# Altium project AlanPC.PrjPcb
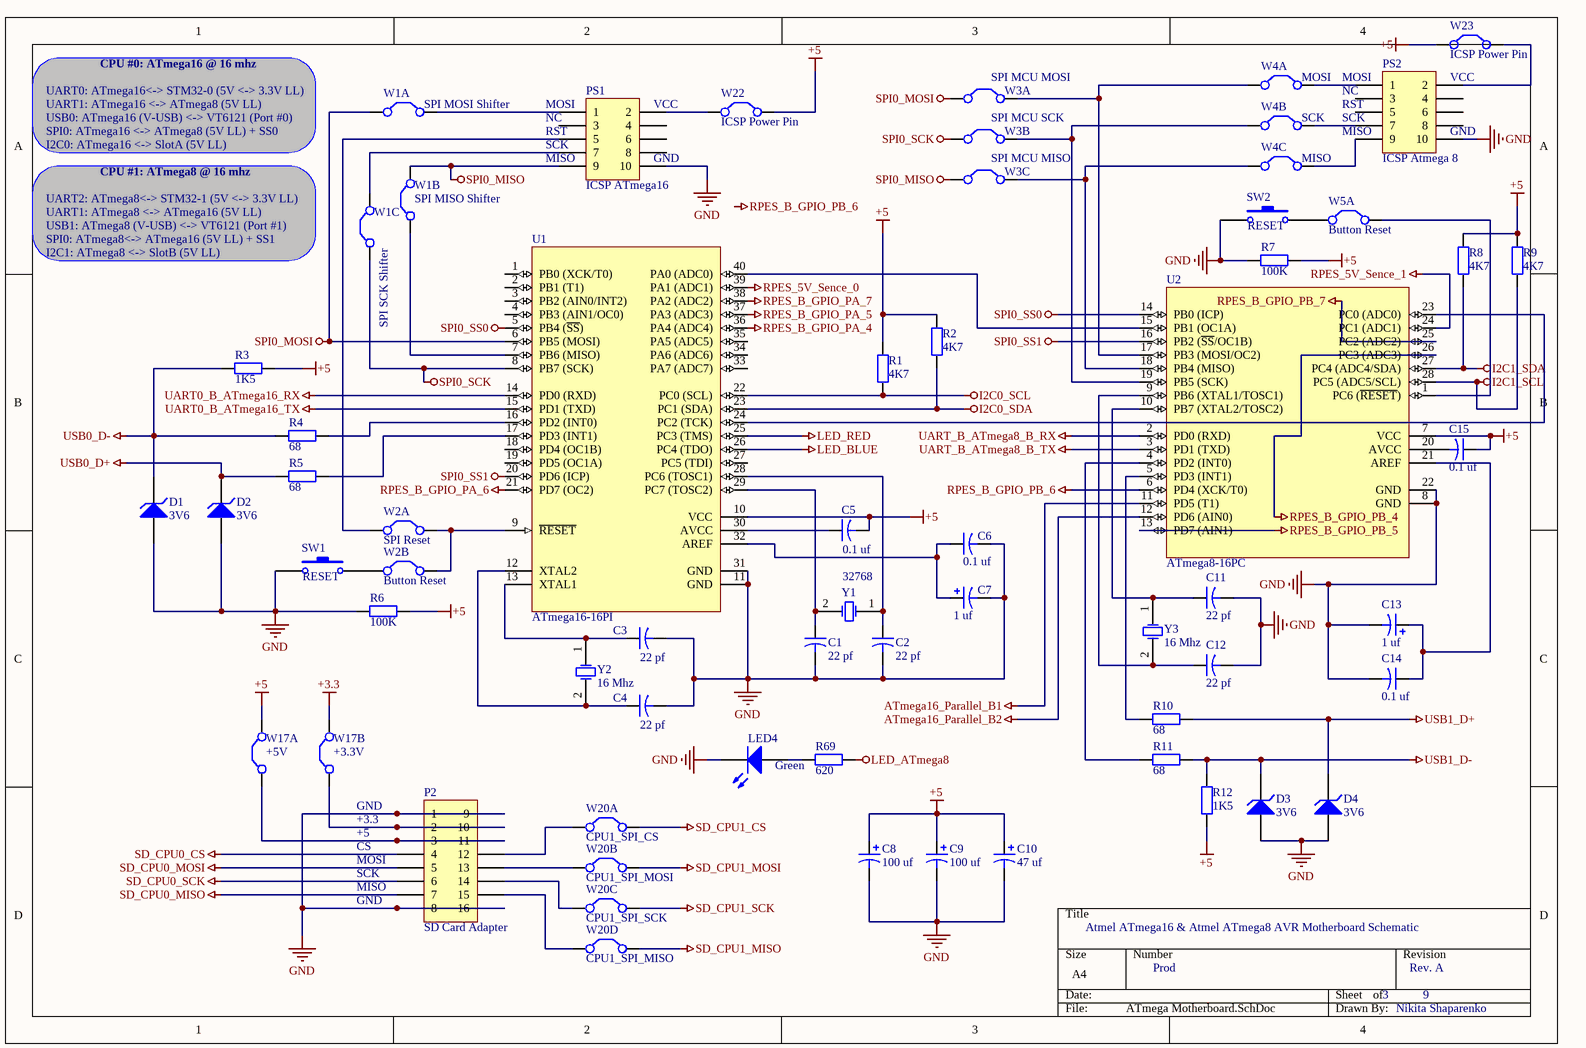
[diagram p0: ATmega Motherboard.SchDoc]
6 sheets, 189 parts. Net scope: global (net labels, ports and power ports of the same name join across sheets).
Board files: PCI long card 5V - 32 BIT.PCBDOC, PCB1.PcbDoc, PCI short card universal - 32 BIT.PCBDOC
Sheets:
  ATmega Motherboard.SchDoc
  STM32 Motherboard.SchDoc
  STM32 Motherboard 2.SchDoc
  Raspberry Pi2+ Expansion Slot.SchDoc
  Shifters.SchDoc
  Sockets.SchDoc

## Sheet ATmega Motherboard.SchDoc
size A4

### Parts
C1  value 22 pf  [CAPR5-4X5]  (hidden comment: Cap2)
C2  value 22 pf  [CAPR5-4X5]  (hidden comment: Cap2)
C3  value 22 pf  [CAPR5-4X5]  (hidden comment: Cap2)
C4  value 22 pf  [CAPR5-4X5]  (hidden comment: Cap2)
C5  value 0.1 uf  [CAPR5-4X5]  (hidden comment: Cap2)
C6  value 0.1 uf  [CAPR5-4X5]  (hidden comment: Cap2)
C7  value 1 uf  [RAD-0.2]  (hidden comment: Cap Pol1)
C8  value 100 uf  [RAD-0.2]  (hidden comment: Cap Pol1)
C9  value 100 uf  [RAD-0.2]  (hidden comment: Cap Pol1)
C10  value 47 uf  [RAD-0.2]  (hidden comment: Cap Pol1)
C11  value 22 pf  [CAPR5-4X5]  (hidden comment: Cap2)
C12  value 22 pf  [CAPR5-4X5]  (hidden comment: Cap2)
C13  value 1 uf  [RAD-0.2]  (hidden comment: Cap Pol1)
C14  value 0.1 uf  [CAPR5-4X5]  (hidden comment: Cap2)
C15  value 0.1 uf  [CAPR5-4X5]  (hidden comment: Cap2)
D1  3V6  [DIODE-0.7]
D2  3V6  [DIODE-0.7]
D3  3V6  [DIODE-0.7]
D4  3V6  [DIODE-0.7]
LED4  Green  [LED-1]
P2  SD Card Adapter  [HDR2X8_CEN]
PS1  ICSP ATmega16  [HDR2X5]
PS2  ICSP Atmega 8  [HDR2X5]
R1  value 4K7  [AXIAL-0.4]  (hidden comment: Res2)
R2  value 4K7  [AXIAL-0.4]  (hidden comment: Res2)
R3  value 1K5  [AXIAL-0.4]  (hidden comment: Res2)
R4  value 68  [AXIAL-0.4]  (hidden comment: Res2)
R5  value 68  [AXIAL-0.4]  (hidden comment: Res2)
R6  value 100K  [AXIAL-0.4]  (hidden comment: Res2)
R7  value 100K  [AXIAL-0.4]  (hidden comment: Res2)
R8  value 4K7  [AXIAL-0.4]  (hidden comment: Res2)
R9  value 4K7  [AXIAL-0.4]  (hidden comment: Res2)
R10  value 68  [AXIAL-0.4]  (hidden comment: Res2)
R11  value 68  [AXIAL-0.4]  (hidden comment: Res2)
R12  value 1K5  [AXIAL-0.4]  (hidden comment: Res2)
R69  value 620  [AXIAL-0.4]  (hidden comment: Res2)
SW1  RESET  [SPST-2]
SW2  RESET  [SPST-2]
U1  ATmega16-16PI  [40P6]
U2  ATmega8-16PC  [28P3]
W1A  SPI MOSI Shifter  [RAD-0.1]
W1B  SPI MISO Shifter  [RAD-0.1]
W1C  SPI SCK Shifter  [RAD-0.1]
W2A  SPI Reset  [RAD-0.1]
W2B  Button Reset  [RAD-0.1]
W3A  SPI MCU MOSI  [RAD-0.1]
W3B  SPI MCU SCK  [RAD-0.1]
W3C  SPI MCU MISO  [RAD-0.1]
W4A  MOSI  [RAD-0.1]
W4B  SCK  [RAD-0.1]
W4C  MISO  [RAD-0.2]
W5A  Button Reset  [RAD-0.1]
W17A  +5V  [RAD-0.1]
W17B  +3.3V  [RAD-0.1]
W20A  CPU1_SPI_CS  [RAD-0.1]
W20B  CPU1_SPI_MOSI  [RAD-0.1]
W20C  CPU1_SPI_SCK  [RAD-0.1]
W20D  CPU1_SPI_MISO  [RAD-0.1]
W22  ICSP Power Pin  [RAD-0.1]
W23  ICSP Power Pin  [RAD-0.1]
Y1  32768  [R38]
Y2  16 Mhz  [R38]
Y3  16 Mhz  [R38]

### Nets
+3.3: W17B.2(C2)
+5: C5.2 C8.1 C9.1 C10.1 C15.1 R1.1 R2.1 R3.1 R6.1 R7.1 R8.1 R9.1 R12.2 U1.10(VCC) U2.7(VCC) W17A.2(C2) W22.2(C2) W23.1(C1)
ATmega16_Parallel_B1: U2.11(PD5_(T1))
ATmega16_Parallel_B2: U2.12(PD6_(AIN0))
GND: C1.2 C2.2 C3.2 C4.2 C6.2 C7.2 C8.2 C9.2 C10.2 C11.2 C12.2 C13.2 C14.2 D1.1(A) D2.1(A) D3.1(A) D4.1(A) LED4.2(K) P2.1 P2.8 P2.9 P2.16 PS1.10 PS2.10 R6.2 R7.2 SW1.1 SW2.1 U1.11(GND) U1.31(GND) U2.8(GND) U2.22(GND)
I2C0_SCL: R1.2 U1.22(PC0_(SCL))
I2C0_SDA: R2.2 U1.23(PC1_(SDA))
I2C1_SCL: R9.2 U2.28(PC5_(ADC5/SCL))
I2C1_SDA: R8.2 U2.27(PC4_(ADC4/SDA))
LED_ATmega8: R69.2
LED_BLUE: U1.26(PC4_(TDO))
LED_RED: U1.25(PC3_(TMS))
RPES_5V_Sence_0: U1.39(PA1_(ADC1))
RPES_5V_Sence_1: U2.24(PC1_(ADC1))
RPES_B_GPIO_PA_4: U1.36(PA4_(ADC4))
RPES_B_GPIO_PA_5: U1.37(PA3_(ADC3))
RPES_B_GPIO_PA_6: U1.21(PD7_(OC2))
RPES_B_GPIO_PA_7: U1.38(PA2_(ADC2))
RPES_B_GPIO_PB_4: U2.26(PC3_(ADC3))
RPES_B_GPIO_PB_5: U2.13(PD7_(AIN1))
RPES_B_GPIO_PB_6: U2.6(PD4_(XCK/T0))
RPES_B_GPIO_PB_7: U2.25(PC2_(ADC2))
SD_CPU0_CS: P2.4
SD_CPU0_MISO: P2.7
SD_CPU0_MOSI: P2.5
SD_CPU0_SCK: P2.6
SD_CPU1_CS: W20A.2(C2)
SD_CPU1_MISO: W20D.2(C2)
SD_CPU1_MOSI: W20B.2(C2)
SD_CPU1_SCK: W20C.2(C2)
SPI0_MISO: PS1.9 W1B.2(C2) W3C.1(C1)
SPI0_MOSI: U1.6(PB5_(MOSI)) W1A.1(C1) W3A.1(C1)
SPI0_SCK: U1.8(PB7_(SCK)) W1C.1(C1) W3B.1(C1)
SPI0_SS0: U1.5(PB4_(~{SS})) U2.14(PB0_(ICP))
SPI0_SS1: U1.20(PD6_(ICP)) U2.16(PB2_(~{SS}/OC1B))
UART0_B_ATmega16_RX: U1.14(PD0_(RXD))
UART0_B_ATmega16_TX: U1.15(PD1_(TXD))
UART_B_ATmega8_B_RX: U2.2(PD0_(RXD))
UART_B_ATmega8_B_TX: U2.3(PD1_(TXD))
USB0_D+: D2.2(K) R5.2
USB0_D-: D1.2(K) R3.2 R4.2
USB1_D+: D4.2(K) R10.2
USB1_D-: D3.2(K) R11.2 R12.1
NetC1_1: C1.1 U1.29(PC7_(TOSC2)) Y1.2(OSC2)
NetC2_1: C2.1 U1.28(PC6_(TOSC1)) Y1.1(OSC1)
NetC3_1: C3.1 U1.13(XTAL1) Y2.1(OSC1)
NetC4_1: C4.1 U1.12(XTAL2) Y2.2(OSC2)
NetC5_1: C5.1 U1.30(AVCC)
NetC6_1: C6.1 C7.1 U1.32(AREF)
NetC11_1: C11.1 U2.10(PB7_(XTAL2/TOSC2)) Y3.1(OSC1)
NetC12_1: C12.1 U2.9(PB6_(XTAL1/TOSC1)) Y3.2(OSC2)
NetC13_1: C13.1 C14.1 U2.21(AREF)
NetC15_2: C15.2 U2.20(AVCC)
NetLED4_1: LED4.1(A) R69.1
NetP2_2: P2.2 P2.10 W17B.1(C1)
NetP2_3: P2.3 P2.11 W17A.1(C1)
NetP2_12: P2.12 W20A.1(C1)
NetP2_13: P2.13 W20B.1(C1)
NetP2_14: P2.14 W20C.1(C1)
NetP2_15: P2.15 W20D.1(C1)
NetPS1_1: PS1.1 W1A.2(C2)
NetPS1_2: PS1.2 W22.1(C1)
NetPS1_5: PS1.5 W2A.1(C1)
NetPS1_7: PS1.7 W1C.2(C2)
NetPS2_1: PS2.1 W4A.2(C2)
NetPS2_2: PS2.2 W23.2(C2)
NetPS2_7: PS2.7 W4B.2(C2)
NetPS2_9: PS2.9 W4C.2(C2)
NetR4_1: R4.1 U1.16(PD2_(INT0))
NetR5_1: R5.1 U1.17(PD3_(INT1))
NetR10_1: R10.1 U2.5(PD3_(INT1))
NetR11_1: R11.1 U2.4(PD2_(INT0))
NetSW1_2: SW1.2 W2B.1(C1)
NetSW2_2: SW2.2 W5A.1(C1)
NetU1_7: U1.7(PB6_(MISO)) W1B.1(C1)
NetU1_9: U1.9(~{RESET}) W2A.2(C2) W2B.2(C2)
NetU1_24: U1.24(PC2_(TCK)) U2.23(PC0_(ADC0))
NetU1_40: U1.40(PA0_(ADC0)) U2.15(PB1_(OC1A))
NetU2_1: U2.1(PC6_(~{RESET})) W5A.2(C2)
NetU2_17: U2.17(PB3_(MOSI/OC2)) W3A.2(C2) W4A.1(C1)
NetU2_18: U2.18(PB4_(MISO)) W3C.2(C2) W4C.1(C1)
NetU2_19: U2.19(PB5_(SCK)) W3B.2(C2) W4B.1(C1)

Not connected (* = marked no-connect by the designer): PS1 3 4 6 8; PS2 3 4 5 6 8; U1 1(PB0_(XCK/T0)) 2(PB1_(T1)) 3(PB2_(AIN0/INT2)) 4(PB3_(AIN1/OC0)) 18(PD4_(OC1B)) 19(PD5_(OC1A)) 27(PC5_(TDI)) 33(PA7_(ADC7)) 34(PA6_(ADC6)) 35(PA5_(ADC5))

### Notes on the sheet
- UART0: ATmega16<-> STM32-0 (5V <-> 3.3V LL)
- USB0: ATmega16 (V-USB) <-> VT6121 (Port #0)
- UART1: ATmega16 <-> ATmega8 (5V LL)
- CPU #0: ATmega16 @ 16 mhz
- (near PS1) MOSI
- (near PS1) NC
- (near PS1) VCC
- (near PS2) MOSI
- NC
- (near PS2) RST
- (near PS2) SCK
- (near PS2) VCC
- SPI0: ATmega16 <-> ATmega8 (5V LL) + SS0
- I2C0: ATmega16 <-> SlotA (5V LL)
- CPU #1: ATmega8 @ 16 mhz
- (near PS1) RST
- (near PS1) SCK
- (near PS1) MISO
- (near PS1) GND
- (near PS2) MISO
- (near PS2) GND
- USB1: ATmega8 (V-USB) <-> VT6121 (Port #1)
- SPI0: ATmega8<-> ATmega16 (5V LL) + SS1
- I2C1: ATmega8 <-> SlotB (5V LL)
- UART1: ATmega8 <-> ATmega16 (5V LL)
- UART2: ATmega8<-> STM32-1 (5V <-> 3.3V LL)
- GND
- +3.3
- +5
- CS
- (near P2) MOSI
- (near P2) GND
- (near P2) SCK
- (near P2) MISO
- Atmel ATmega16 & Atmel ATmega8 AVR Motherboard Schematic
- Prod
- 3
- Rev. A
- 9
- Nikita Shaparenko
- Labels drawn without touching a wire or pin: RPES_B_GPIO_PB_6

### Library data of the parts
C1-C6 C11 C12 C14 C15 = Cap2: Capacitor; Published: 23-Sep-2002; PackageReference: CAPR5-4X5; Publisher: Altium Limited; PackageDescription: Capacitor; 2 Leads
C7-C10 C13 = Cap Pol1: Polarized Capacitor (Radial); Published: 8-Jun-2000; LatestRevisionDate: 17-Jul-2002; LatestRevisionNote: Re-released for DXP Platform.; PackageReference: RB7.6-15; Publisher: Altium Limited; PackageDescription: Polarized Capacitor (Radial); 2 Leads
D1-D4 = D Zener: Zener Diode; Published: 8-Jun-2000; LatestRevisionDate: 17-Jul-2002; LatestRevisionNote: Re-released for DXP Platform.; PackageReference: DIODE-0.7; Publisher: Altium Limited; PackageDescription: Diode, Thru-Hole; 2 Leads; 0.7 in Pin Spacing
LED4 = LED1: Typical RED GaAs LED; Published: 8-Jun-2000; LatestRevisionDate: 08-Jul-2005; LatestRevisionNote: Mech Layer 1 removed.; PackageReference: LED-1; Publisher: Altium Limited; PackageDescription: LED; 2 Leads
P2 = Header 8X2A: Header, 8-Pin, Dual row; LatestRevisionDate: 17-Jul-2002; LatestRevisionNote: Re-released for DXP Platform.; Publisher: Altium Limited
PS1 PS2 = Header 5X2: Header, 5-Pin, Dual row; LatestRevisionDate: 17-Jul-2002; LatestRevisionNote: Re-released for DXP Platform.; Publisher: Altium Limited
R1-R12 R69 = Res2: Resistor; Published: 8-Jun-2000; LatestRevisionDate: 17-Jul-2002; LatestRevisionNote: Re-released for DXP Platform.; PackageReference: AXIAL-0.4; Publisher: Altium Limited; PackageDescription: Axial Device, Thru-Hole; 2 Leads; 0.4 in Pin Spacing
SW1 SW2 = SW-PB: Switch; Published: 24-Mar-1999; LatestRevisionDate: 17-Jul-2002; LatestRevisionNote: Re-released for DXP Platform.; PackageReference: SPST-2; Publisher: Altium Limited; PackageDescription: Switch; 2 Leads
U1 = ATmega16-16PI: 8-Bit AVR Microcontroller with 16K Bytes of In-System Programmable Flash Memory; Published: 17-Sep-2003; DatasheetVersion: 2466E-AVR-10/02; PackageVersion: revB, Sep-2001; PackageReference: 40P6; Publisher: Altium Limited; PackageDescription: 40-lead (0.600"/15.24mm Wide) Plastic Dual Inline Package (PDIP); Supplier 1: Digi-Key; Supplier Part Number 1: ATMEGA16-16PI-ND; Supplier 2: Mouser; Supplier Part Number 2: 556-ATMEGA16-16PI; Code_JEDEC: MS-011-AC; ComponentLink1Description: Datasheet; ComponentLink1URL: http://www.atmel.com/dyn/resources/prod_documents/doc2466.pdf; ComponentLink2Description: Atmel.com Home; ComponentLink2URL: http://www.atmel.com
U2 = ATmega8-16PC: 8-Bit AVR Microcontroller with 8K Bytes of In-System Programmable Flash Memory; Published: 17-Sep-2003; DatasheetVersion: 2486H-AVR-09/02; PackageVersion: revB, Sep-2001; PackageReference: 28P3; Publisher: Altium Limited; PackageDescription: 28-lead (0.300"/7.62mm Wide) Plastic Dual Inline Package (PDIP); Supplier 1: Digi-Key; Supplier Part Number 1: ATMEGA8-16PC-ND; Supplier 2: Mouser; Supplier Part Number 2: 556-ATMEGA8-16PC; ComponentLink1Description: Datasheet; ComponentLink1URL: http://www.atmel.com/dyn/resources/prod_documents/doc2486.pdf; ComponentLink2Description: Atmel.com Home; ComponentLink2URL: http://www.atmel.com
W1A W1B W1C W2A W2B W3A W3B W3C W4A W4B W4C W5A W17A W17B W20A W20B W20C W20D W22 W23 = Jumper: Jumper Wire; Published: 24-Mar-1999; LatestRevisionDate: 17-Jul-2002; LatestRevisionNote: Re-released for DXP Platform.; PackageReference: RAD-0.2; Publisher: Altium Limited; PackageDescription: Radial Cap, Thru-Hole; 2 Leads; 0.2 in Pin Spacing
Y1-Y3 = XTAL: Crystal Oscillator; Published: 8-Jun-2000; LatestRevisionDate: 17-Jul-2002; LatestRevisionNote: Re-released for DXP Platform.; PackageReference: R38; Publisher: Altium Limited; PackageDescription: Crystal, Thru-Hole; 2 Leads; Body 3.1 x 8.2 mm (Dia.xH)

## Sheet STM32 Motherboard.SchDoc
size A4
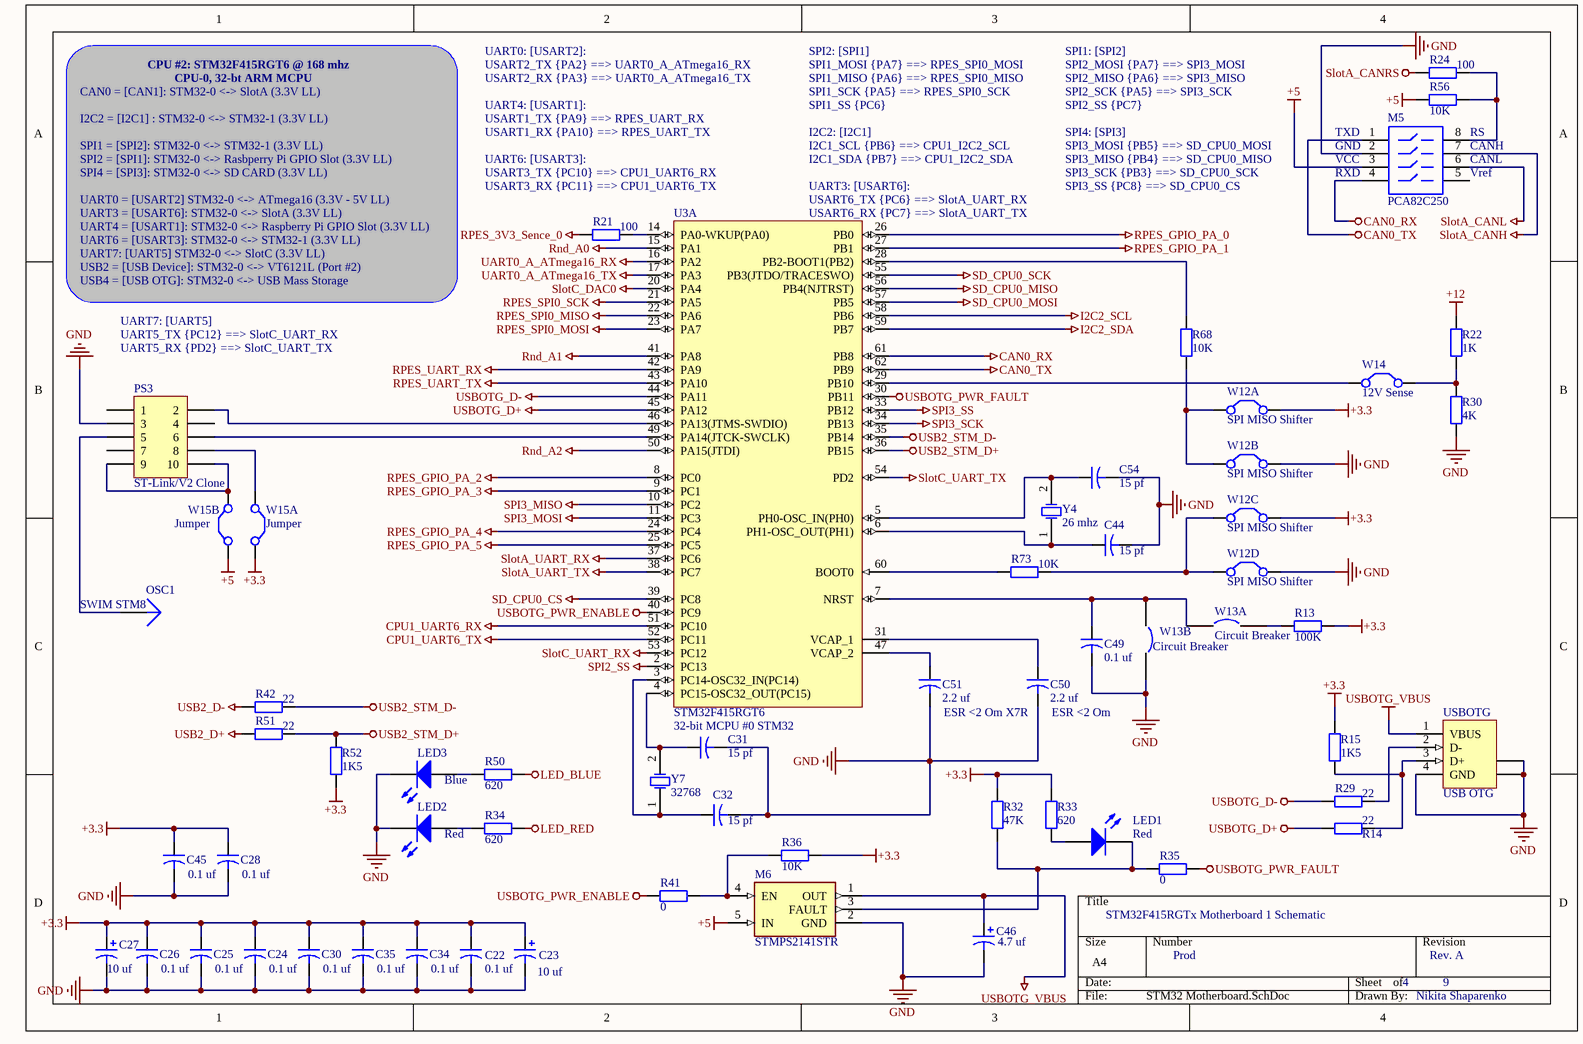
[diagram p1: STM32 Motherboard.SchDoc]

### Parts
C22  value 0.1 uf  [CAPR5-4X5]  (hidden comment: Cap2)
C23  value 10 uf  [RAD-0.2]  (hidden comment: Cap Pol1)
C24  value 0.1 uf  [CAPR5-4X5]  (hidden comment: Cap2)
C25  value 0.1 uf  [CAPR5-4X5]  (hidden comment: Cap2)
C26  value 0.1 uf  [CAPR5-4X5]  (hidden comment: Cap2)
C27  value 10 uf  [RAD-0.2]  (hidden comment: Cap Pol1)
C28  value 0.1 uf  [CAPR5-4X5]  (hidden comment: Cap2)
C30  value 0.1 uf  [CAPR5-4X5]  (hidden comment: Cap2)
C31  value 15 pf  [CAPR5-4X5]  (hidden comment: Cap2)
C32  value 15 pf  [CAPR5-4X5]  (hidden comment: Cap2)
C34  value 0.1 uf  [CAPR5-4X5]  (hidden comment: Cap2)
C35  value 0.1 uf  [CAPR5-4X5]  (hidden comment: Cap2)
C44  value 15 pf  [CAPR5-4X5]  (hidden comment: Cap2)
C45  value 0.1 uf  [CAPR5-4X5]  (hidden comment: Cap2)
C46  value 4.7 uf  [RAD-0.2]  (hidden comment: Cap Pol1)
C49  value 0.1 uf  [CAPR5-4X5]  (hidden comment: Cap2)
C50  ESR <2 Om  value 2.2 uf  [CAPR5-4X5]
C51  ESR <2 Om X7R  value 2.2 uf  [CAPR5-4X5]
C54  value 15 pf  [CAPR5-4X5]  (hidden comment: Cap2)
LED1  Red  [LED-1]
LED2  Red  [LED-1]
LED3  Blue  [LED-1]
M5  PCA82C250  [8S1_N]
M6  STMPS2141STR  [SOT95P280X145-5N]
OSC1  SWIM STM8  [PIN1]
PS3  ST-Link/V2 Clone  [HDR2X5]
R13  value 100K  [AXIAL-0.4]  (hidden comment: Res2)
R14  value 22  [AXIAL-0.4]  (hidden comment: Res2)
R15  value 1K5  [AXIAL-0.4]  (hidden comment: Res2)
R21  value 100  [AXIAL-0.4]  (hidden comment: Res2)
R22  value 1K  [AXIAL-0.4]  (hidden comment: Res2)
R24  value 100  [AXIAL-0.4]  (hidden comment: Res2)
R29  value 22  [AXIAL-0.4]  (hidden comment: Res2)
R30  value 4K  [AXIAL-0.4]  (hidden comment: Res2)
R32  value 47K  [AXIAL-0.4]  (hidden comment: Res2)
R33  value 620  [AXIAL-0.4]  (hidden comment: Res2)
R34  value 620  [AXIAL-0.4]  (hidden comment: Res2)
R35  value 0  [AXIAL-0.4]  (hidden comment: Res2)
R36  value 10K  [AXIAL-0.4]  (hidden comment: Res2)
R41  value 0  [AXIAL-0.4]  (hidden comment: Res2)
R42  value 22  [AXIAL-0.4]  (hidden comment: Res2)
R50  value 620  [AXIAL-0.4]  (hidden comment: Res2)
R51  value 22  [AXIAL-0.4]  (hidden comment: Res2)
R52  value 1K5  [AXIAL-0.4]  (hidden comment: Res2)
R56  value 10K  [AXIAL-0.4]  (hidden comment: Res2)
R68  value 10K  [AXIAL-0.4]  (hidden comment: Res2)
R73  value 10K  [AXIAL-0.4]  (hidden comment: Res2)
U3  STM32F415RGT6  [STM-LQFP64_N]  (part A of 2)
USBOTG  USB OTG  [1470695A]
W12A  SPI MISO Shifter  [RAD-0.1]
W12B  SPI MISO Shifter  [RAD-0.1]
W12C  SPI MISO Shifter  [RAD-0.1]
W12D  SPI MISO Shifter  [RAD-0.1]
W13A  Circuit Breaker  [SPST-2]
W13B  Circuit Breaker  [SPST-2]
W14  12V Sense  [RAD-0.1]
W15A  Jumper  [RAD-0.1]
W15B  Jumper  [RAD-0.1]
Y4  26 mhz  [R38]
Y7  32768  [R38]

### Nets
+3.3: C22.1 C23.1 C24.1 C25.1 C26.1 C27.1 C28.1 C30.1 C34.1 C35.1 C45.1 R13.1 R15.2 R32.2 R33.2 R36.1 R52.1 W12A.2(C2) W12C.2(C2) W15A.2(C2)
+5: M5.3 M6.5(IN) R56.2 W15B.1(C1)
+12: R22.2
CAN0_RX: M5.4 U3.61(PB8)
CAN0_TX: M5.1 U3.62(PB9)
CPU1_UART6_RX: U3.51(PC10)
CPU1_UART6_TX: U3.52(PC11)
GND: C22.2 C23.2 C24.2 C25.2 C26.2 C27.2 C28.2 C30.2 C31.2 C32.2 C34.2 C35.2 C44.2 C45.2 C46.2 C49.2 C50.2 C51.2 C54.2 LED2.2(K) LED3.2(K) M5.2 M6.2(GND) PS3.3 R30.1 USBOTG.4(GND) USBOTG.5(SHLD) USBOTG.6(SHLD) W12B.2(C2) W12D.2(C2) W13B.2
I2C2_SCL: U3.58(PB6)
I2C2_SDA: U3.59(PB7)
LED_BLUE: R50.2
LED_RED: R34.2
Rnd_A0: U3.15(PA1)
Rnd_A1: U3.41(PA8)
Rnd_A2: U3.50(PA15(JTDI))
RPES_3V3_Sence_0: R21.1
RPES_GPIO_PA_0: U3.26(PB0)
RPES_GPIO_PA_1: U3.27(PB1)
RPES_GPIO_PA_2: U3.8(PC0)
RPES_GPIO_PA_3: U3.9(PC1)
RPES_GPIO_PA_4: U3.24(PC4)
RPES_GPIO_PA_5: U3.25(PC5)
RPES_SPI0_MISO: U3.22(PA6)
RPES_SPI0_MOSI: U3.23(PA7)
RPES_SPI0_SCK: U3.21(PA5)
RPES_UART_RX: U3.42(PA9)
RPES_UART_TX: U3.43(PA10)
SD_CPU0_CS: U3.39(PC8)
SD_CPU0_MISO: U3.56(PB4(NJTRST))
SD_CPU0_MOSI: U3.57(PB5)
SD_CPU0_SCK: U3.55(PB3(JTDO/TRACESWO))
SlotA_CANH: M5.7
SlotA_CANL: M5.6
SlotA_CANRS: R24.1
SlotA_UART_RX: U3.37(PC6)
SlotA_UART_TX: U3.38(PC7)
SlotC_DAC0: U3.20(PA4)
SlotC_UART_RX: U3.53(PC12)
SlotC_UART_TX: U3.54(PD2)
SPI2_SS: U3.2(PC13)
SPI3_MISO: U3.10(PC2)
SPI3_MOSI: U3.11(PC3)
SPI3_SCK: U3.34(PB13)
SPI3_SS: U3.33(PB12)
UART0_A_ATmega16_RX: U3.16(PA2)
UART0_A_ATmega16_TX: U3.17(PA3)
USB2_D+: R51.1
USB2_D-: R42.1
USB2_STM_D+: R51.2 R52.2 U3.36(PB15)
USB2_STM_D-: R42.2 U3.35(PB14)
USBOTG_D+: R14.1 U3.45(PA12)
USBOTG_D-: R29.1 U3.44(PA11)
USBOTG_PWR_ENABLE: R41.2 U3.40(PC9)
USBOTG_PWR_FAULT: R35.2 U3.30(PB11)
USBOTG_VBUS: C46.1 M6.1(OUT) USBOTG.1(VBUS)
NetC31_1: C31.1 U3.4(PC15-OSC32_OUT(PC15)) Y7.2(OSC2)
NetC32_1: C32.1 U3.3(PC14-OSC32_IN(PC14)) Y7.1(OSC1)
NetC44_1: C44.1 U3.6(PH1-OSC_OUT(PH1)) Y4.1(OSC1)
NetC49_1: C49.1 U3.7(NRST) W13A.1 W13B.1
NetC50_1: C50.1 U3.31(VCAP_1)
NetC51_1: C51.1 U3.47(VCAP_2)
NetC54_1: C54.1 U3.5(PH0-OSC_IN(PH0)) Y4.2(OSC2)
NetLED1_1: LED1.1(A) R33.1
NetLED1_2: LED1.2(K) M6.3(FAULT) R32.1 R35.1
NetLED2_1: LED2.1(A) R34.1
NetLED3_1: LED3.1(A) R50.1
NetM5_8: M5.8 R24.2 R56.1
NetM6_4: M6.4(EN) R36.2 R41.1
NetOSC1_1: OSC1.1 PS3.5
NetPS3_2: PS3.2 U3.46(PA13(JTMS-SWDIO))
NetPS3_6: PS3.6 U3.49(PA14(JTCK-SWCLK))
NetPS3_8: PS3.8 W15A.1(C1)
NetPS3_9: PS3.9 PS3.10 W15B.2(C2)
NetR13_2: R13.2 W13A.2
NetR14_2: R14.2 R15.1 USBOTG.3(D+)
NetR21_2: R21.2 U3.14(PA0-WKUP(PA0))
NetR22_1: R22.1 R30.2 W14.2(C2)
NetR29_2: R29.2 USBOTG.2(D-)
NetR68_1: R68.1 W12A.1(C1) W12B.1(C1)
NetR68_2: R68.2 U3.28(PB2-BOOT1(PB2))
NetR73_1: R73.1 U3.60(BOOT0)
NetR73_2: R73.2 W12C.1(C1) W12D.1(C1)
NetU3_29: U3.29(PB10) W14.1(C1)

Not connected (* = marked no-connect by the designer): M5 5; PS3 1 4 7

### Notes on the sheet
- CAN0 = [CAN1]: STM32-0 <-> SlotA (3.3V LL)
- CPU #2: STM32F415RGT6 @ 168 mhz
- CPU-0, 32-bt ARM MCPU
- UART0: [USART2]:
- USART2_TX {PA2} ==> UART0_A_ATmega16_RX
- USART2_RX {PA3} ==> UART0_A_ATmega16_TX
- UART4: [USART1]:
- SPI2: [SPI1]
- SPI1_MOSI {PA7} ==> RPES_SPI0_MOSI
- SPI1_MISO {PA6} ==> RPES_SPI0_MISO
- SPI1_SCK {PA5} ==> RPES_SPI0_SCK
- SPI1_SS {PC6}
- SPI1: [SPI2]
- SPI2_MOSI {PA7} ==> SPI3_MOSI
- SPI2_MISO {PA6} ==> SPI3_MISO
- SPI2_SCK {PA5} ==> SPI3_SCK
- SPI2_SS {PC7}
- SPI2 = [SPI1]: STM32-0 <-> Rasbperry Pi GPIO Slot (3.3V LL)
- SPI4 = [SPI3]: STM32-0 <-> SD CARD (3.3V LL)
- I2C2 = [I2C1] : STM32-0 <-> STM32-1 (3.3V LL)
- SPI1 = [SPI2]: STM32-0 <-> STM32-1 (3.3V LL)
- USART1_TX {PA9} ==> RPES_UART_RX
- USART1_RX {PA10} ==> RPES_UART_TX
- UART6: [USART3]:
- USART3_TX {PC10} ==> CPU1_UART6_RX
- I2C2: [I2C1]
- I2C1_SCL {PB6} ==> CPU1_I2C2_SCL
- I2C1_SDA {PB7} ==> CPU1_I2C2_SDA
- SPI4: [SPI3]
- SPI3_MOSI {PB5} ==> SD_CPU0_MOSI
- SPI3_MISO {PB4} ==> SD_CPU0_MISO
- SPI3_SCK {PB3} ==> SD_CPU0_SCK
- (near M5) TXD
- (near M5) GND
- (near M5) VCC
- (near M5) RXD
- RS
- CANH
- (near M5) CANL
- (near M5) Vref
- UART4 = [USART1]: STM32-0 <-> Raspberry Pi GPIO Slot (3.3V LL)
- UART6 = [USART3]: STM32-0 <-> STM32-1 (3.3V LL)
- UART0 = [USART2] STM32-0 <-> ATmega16 (3.3V - 5V LL)
- UART3 = [USART6]: STM32-0 <-> SlotA (3.3V LL)
- USART3_RX {PC11} ==> CPU1_UART6_TX
- (near U3) UART3: [USART6]:
- (near U3) USART6_TX {PC6} ==> SlotA_UART_RX
- (near U3) USART6_RX {PC7} ==> SlotA_UART_TX
- SPI3_SS {PC8} ==> SD_CPU0_CS
- USB4 = [USB OTG]: STM32-0 <-> USB Mass Storage
- USB2 = [USB Device]: STM32-0 <-> VT6121L (Port #2)
- UART7: [UART5] STM32-0 <-> SlotC (3.3V LL)
- UART7: [UART5]
- UART5_TX {PC12} ==> SlotC_UART_RX
- UART5_RX {PD2} ==> SlotC_UART_TX
- (near C31) 32-bit MCPU #0 STM32
- (near R35) STM32F415RGTx Motherboard 1 Schematic
- Prod
- 4
- Rev. A
- 9
- Nikita Shaparenko

### Library data of the parts
C22 C24-C26 C28 C30-C32 C34 C35 C44 C45 C49-C51 C54 = Cap2: Capacitor; Published: 23-Sep-2002; PackageReference: CAPR5-4X5; Publisher: Altium Limited; PackageDescription: Capacitor; 2 Leads
C23 C27 C46 = Cap Pol1: Polarized Capacitor (Radial); Published: 8-Jun-2000; LatestRevisionDate: 17-Jul-2002; LatestRevisionNote: Re-released for DXP Platform.; PackageReference: RB7.6-15; Publisher: Altium Limited; PackageDescription: Polarized Capacitor (Radial); 2 Leads
LED1-LED3 = LED1: Typical RED GaAs LED; Published: 8-Jun-2000; LatestRevisionDate: 08-Jul-2005; LatestRevisionNote: Mech Layer 1 removed.; PackageReference: LED-1; Publisher: Altium Limited; PackageDescription: LED; 2 Leads
M5 = SW-DIP4: DIP Switch; Published: 24-Mar-1999; LatestRevisionDate: 17-Jul-2002; LatestRevisionNote: Re-released for DXP Platform.; PackageReference: DIP-8; Publisher: Altium Limited
M6 = STMPS2141STR: Power Switch/Driver 1:1 N-Channel 500mA SOT-23-5; MF: STMicroelectronics; Price: None; MP: STMPS2141STR; Package: SOT-23 STMicroelectronics; Value: *; Availability: Unavailable; SnapEDA_Link: https://www.snapeda.com/parts/STMPS2141STR/STMicroelectronics/view-part/278790/?ref=snap
OSC1 = Plug: LatestRevisionDate: 17-Jul-2002; LatestRevisionNote: Re-released for DXP Platform.; Publisher: Altium Limited
PS3 = Header 5X2: Header, 5-Pin, Dual row; LatestRevisionDate: 17-Jul-2002; LatestRevisionNote: Re-released for DXP Platform.; Publisher: Altium Limited
R13-R15 R21 R22 R24 R29 R30 R32-R36 R41 R42 R50-R52 R56 R68 R73 = Res2: Resistor; Published: 8-Jun-2000; LatestRevisionDate: 17-Jul-2002; LatestRevisionNote: Re-released for DXP Platform.; PackageReference: AXIAL-0.4; Publisher: Altium Limited; PackageDescription: Axial Device, Thru-Hole; 2 Leads; 0.4 in Pin Spacing
U3 = STM32F415RGT6: ARM Cortex-M4 32-bit MCU+FPU, 210 DMIPS, 1024 kB Flash, 192 kB Internal RAM, 51 I/Os, 64-pin LQFP, -40 to 85 degC, Tray; Manufacturer: STMicroelectronics; D/A Converter: 2x12-bit; FLASH Size (Prog) (kB): 1024; I/Os (High Current): 51; Internal RAM Size (kB): 192; Operating Frequency(F) (Processor speed) (MHz): 168; Supply Voltage(Vcc) max (V): 3.6; Supply Voltage(Vcc) min (V): 1.8; DatasheetVersion: Rev. 4; PackageVersion: Rev. 4, 06/2013; PackageReference: LQFP64; PackageDescription: 64-Pin Low Profile Quad Flat Package, 10 x 10 mm Body, 0.5 mm Pitch; Supplier 1: Digi-Key; Supplier Part Number 1: 497-11907-ND; Supplier 2: Farnell; Supplier Part Number 2: 2064370; Supplier 3: Newark; Supplier Part Number 3: 73T2335; Supplier 4: Mouser; Supplier Part Number 4: 511-STM32F415RGT6; Core: ARM Cortex-M4; Packing: Tray; Mounting Technology: Surface Mount; PartNumber: STM32F415RGT6; ComponentLink1Description: Manufacturer URL; ComponentLink1URL: http://www.st.com/web/en/home.html; ComponentLink2Description: Datasheet; ComponentLink2URL: http://www.st.com/st-web-ui/static/active/en/resource/technical/document/datasheet/DM00035129.pdf; ComponentLink3Description: Package Specification; ComponentLink3URL: http://www.st.com/st-web-ui/static/active/en/resource/technical/document/datasheet/DM00037051.pdf
USBOTG = 1470695-2: USB 1.1, Right Angle, SMT, A Type, Plug, 4 Position, Natural; ContactMaterial: Brass; ContactPlating: Gold (30) over Nickel (50); PCB_Layout: Complies with manufacturer's recommendation.; DrillSize: Corresponds to nominal value.; PanelGround: Without; Published: 15-Jul-2004; DatasheetDocument: 21-Jan-2003; PackageDocument: 21-Jan-2003; PackageReference: 1470695A; Publisher: Altium Limited; HousingMaterial: Thermoplastic; ComponentLink1Description: Manufacturer Link; ComponentLink1URL: http://www.tycoelectronics.com/; ComponentLink2Description: Packaging Specification; ComponentLink2URL: http://ecommas.tycoelectronics.com/commerce/DocumentDelivery/DDEController?Action=showdoc&DocId=Customer+Drawing%7F1470695%7FO%7Fpdf%7FEnglish%7FC_1470695_O.pdf
W12A W12B W12C W12D W14 W15A W15B = Jumper: Jumper Wire; Published: 24-Mar-1999; LatestRevisionDate: 17-Jul-2002; LatestRevisionNote: Re-released for DXP Platform.; PackageReference: RAD-0.2; Publisher: Altium Limited; PackageDescription: Radial Cap, Thru-Hole; 2 Leads; 0.2 in Pin Spacing
Y4 Y7 = XTAL: Crystal Oscillator; Published: 8-Jun-2000; LatestRevisionDate: 17-Jul-2002; LatestRevisionNote: Re-released for DXP Platform.; PackageReference: R38; Publisher: Altium Limited; PackageDescription: Crystal, Thru-Hole; 2 Leads; Body 3.1 x 8.2 mm (Dia.xH)
W13A W13B = Circuit Breaker: Published: 24-Mar-1999; LatestRevisionDate: 17-Jul-2002; LatestRevisionNote: Re-released for DXP Platform.; PackageReference: SPST-2; Publisher: Altium Limited; PackageDescription: Switch; 2 Leads

## Sheet STM32 Motherboard 2.SchDoc
size A4
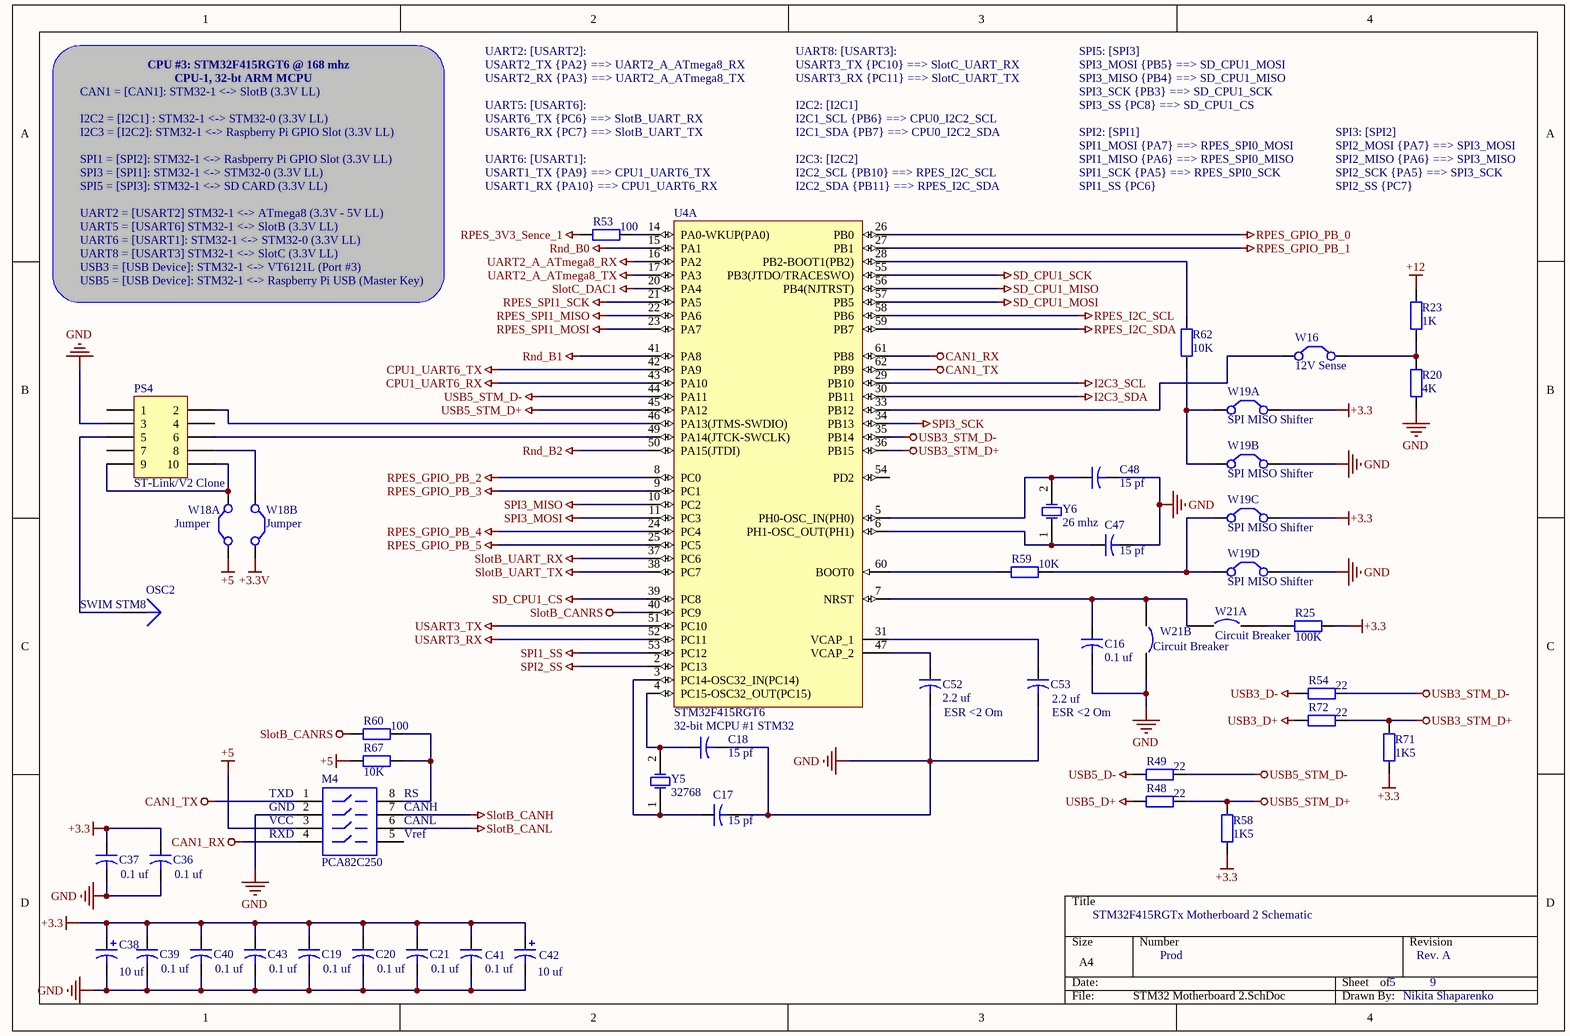
[diagram p2: STM32 Motherboard 2.SchDoc]

### Parts
C16  value 0.1 uf  [CAPR5-4X5]  (hidden comment: Cap2)
C17  value 15 pf  [CAPR5-4X5]  (hidden comment: Cap2)
C18  value 15 pf  [CAPR5-4X5]  (hidden comment: Cap2)
C19  value 0.1 uf  [CAPR5-4X5]  (hidden comment: Cap2)
C20  value 0.1 uf  [CAPR5-4X5]  (hidden comment: Cap2)
C21  value 0.1 uf  [CAPR5-4X5]  (hidden comment: Cap2)
C36  value 0.1 uf  [CAPR5-4X5]  (hidden comment: Cap2)
C37  value 0.1 uf  [CAPR5-4X5]  (hidden comment: Cap2)
C38  value 10 uf  [RAD-0.2]  (hidden comment: Cap Pol1)
C39  value 0.1 uf  [CAPR5-4X5]  (hidden comment: Cap2)
C40  value 0.1 uf  [CAPR5-4X5]  (hidden comment: Cap2)
C41  value 0.1 uf  [CAPR5-4X5]  (hidden comment: Cap2)
C42  value 10 uf  [RAD-0.2]  (hidden comment: Cap Pol1)
C43  value 0.1 uf  [CAPR5-4X5]  (hidden comment: Cap2)
C47  value 15 pf  [CAPR5-4X5]  (hidden comment: Cap2)
C48  value 15 pf  [CAPR5-4X5]  (hidden comment: Cap2)
C52  ESR <2 Om  value 2.2 uf  [CAPR5-4X5]
C53  ESR <2 Om  value 2.2 uf  [CAPR5-4X5]
M4  PCA82C250  [8S1_N]
OSC2  SWIM STM8  [PIN1]
PS4  ST-Link/V2 Clone  [HDR2X5]
R20  value 4K  [AXIAL-0.4]  (hidden comment: Res2)
R23  value 1K  [AXIAL-0.4]  (hidden comment: Res2)
R25  value 100K  [AXIAL-0.4]  (hidden comment: Res2)
R48  value 22  [AXIAL-0.4]  (hidden comment: Res2)
R49  value 22  [AXIAL-0.4]  (hidden comment: Res2)
R53  value 100  [AXIAL-0.4]  (hidden comment: Res2)
R54  value 22  [AXIAL-0.4]  (hidden comment: Res2)
R58  value 1K5  [AXIAL-0.4]  (hidden comment: Res2)
R59  value 10K  [AXIAL-0.4]  (hidden comment: Res2)
R60  value 100  [AXIAL-0.4]  (hidden comment: Res2)
R62  value 10K  [AXIAL-0.4]  (hidden comment: Res2)
R67  value 10K  [AXIAL-0.4]  (hidden comment: Res2)
R71  value 1K5  [AXIAL-0.4]  (hidden comment: Res2)
R72  value 22  [AXIAL-0.4]  (hidden comment: Res2)
U4  STM32F415RGT6  [STM-LQFP64_N]  (part A of 2)
W16  12V Sense  [RAD-0.1]
W18A  Jumper  [RAD-0.1]
W18B  Jumper  [RAD-0.1]
W19A  SPI MISO Shifter  [RAD-0.1]
W19B  SPI MISO Shifter  [RAD-0.1]
W19C  SPI MISO Shifter  [RAD-0.1]
W19D  SPI MISO Shifter  [RAD-0.1]
W21A  Circuit Breaker  [SPST-2]
W21B  Circuit Breaker  [SPST-2]
Y5  32768  [R38]
Y6  26 mhz  [R38]

### Nets
+3.3: C19.1 C20.1 C21.1 C36.1 C37.1 C38.1 C39.1 C40.1 C41.1 C42.1 C43.1 R25.1 R58.1 R71.1 W19A.2(C2) W19C.2(C2)
+3.3V: W18B.2(C2)
+5: M4.3 R67.2 W18A.1(C1)
+12: R23.2
CAN1_RX: M4.4 U4.61(PB8)
CAN1_TX: M4.1 U4.62(PB9)
CPU1_UART6_RX: U4.43(PA10)
CPU1_UART6_TX: U4.42(PA9)
GND: C16.2 C17.2 C18.2 C19.2 C20.2 C21.2 C36.2 C37.2 C38.2 C39.2 C40.2 C41.2 C42.2 C43.2 C47.2 C48.2 C52.2 C53.2 M4.2 PS4.3 R20.1 W19B.2(C2) W19D.2(C2) W21B.2
I2C3_SCL: U4.29(PB10)
I2C3_SDA: U4.30(PB11)
Rnd_B0: U4.15(PA1)
Rnd_B1: U4.41(PA8)
Rnd_B2: U4.50(PA15(JTDI))
RPES_3V3_Sence_1: R53.1
RPES_GPIO_PB_0: U4.26(PB0)
RPES_GPIO_PB_1: U4.27(PB1)
RPES_GPIO_PB_2: U4.8(PC0)
RPES_GPIO_PB_3: U4.9(PC1)
RPES_GPIO_PB_4: U4.24(PC4)
RPES_GPIO_PB_5: U4.25(PC5)
RPES_I2C_SCL: U4.58(PB6)
RPES_I2C_SDA: U4.59(PB7)
RPES_SPI1_MISO: U4.22(PA6)
RPES_SPI1_MOSI: U4.23(PA7)
RPES_SPI1_SCK: U4.21(PA5)
SD_CPU1_CS: U4.39(PC8)
SD_CPU1_MISO: U4.56(PB4(NJTRST))
SD_CPU1_MOSI: U4.57(PB5)
SD_CPU1_SCK: U4.55(PB3(JTDO/TRACESWO))
SlotB_CANH: M4.7
SlotB_CANL: M4.6
SlotB_CANRS: R60.1 U4.40(PC9)
SlotB_UART_RX: U4.37(PC6)
SlotB_UART_TX: U4.38(PC7)
SlotC_DAC1: U4.20(PA4)
SPI1_SS: U4.53(PC12)
SPI2_SS: U4.2(PC13)
SPI3_MISO: U4.10(PC2)
SPI3_MOSI: U4.11(PC3)
SPI3_SCK: U4.34(PB13)
UART2_A_ATmega8_RX: U4.16(PA2)
UART2_A_ATmega8_TX: U4.17(PA3)
USART3_RX: U4.52(PC11)
USART3_TX: U4.51(PC10)
USB3_D+: R72.1
USB3_D-: R54.1
USB3_STM_D+: R71.2 R72.2 U4.36(PB15)
USB3_STM_D-: R54.2 U4.35(PB14)
USB5_D+: R48.1
USB5_D-: R49.1
USB5_STM_D+: R48.2 R58.2 U4.45(PA12)
USB5_STM_D-: R49.2 U4.44(PA11)
NetC16_1: C16.1 U4.7(NRST) W21A.1 W21B.1
NetC17_1: C17.1 U4.3(PC14-OSC32_IN(PC14)) Y5.1(OSC1)
NetC18_1: C18.1 U4.4(PC15-OSC32_OUT(PC15)) Y5.2(OSC2)
NetC47_1: C47.1 U4.6(PH1-OSC_OUT(PH1)) Y6.1(OSC1)
NetC48_1: C48.1 U4.5(PH0-OSC_IN(PH0)) Y6.2(OSC2)
NetC52_1: C52.1 U4.47(VCAP_2)
NetC53_1: C53.1 U4.31(VCAP_1)
NetM4_8: M4.8 R60.2 R67.1
NetOSC2_1: OSC2.1 PS4.5
NetPS4_2: PS4.2 U4.46(PA13(JTMS-SWDIO))
NetPS4_6: PS4.6 U4.49(PA14(JTCK-SWCLK))
NetPS4_8: PS4.8 W18B.1(C1)
NetPS4_9: PS4.9 PS4.10 W18A.2(C2)
NetR20_2: R20.2 R23.1 W16.2(C2)
NetR25_2: R25.2 W21A.2
NetR53_2: R53.2 U4.14(PA0-WKUP(PA0))
NetR59_1: R59.1 U4.60(BOOT0)
NetR59_2: R59.2 W19C.1(C1) W19D.1(C1)
NetR62_1: R62.1 W19A.1(C1) W19B.1(C1)
NetR62_2: R62.2 U4.28(PB2-BOOT1(PB2))
NetU4_33: U4.33(PB12) W16.1(C1)

Not connected (* = marked no-connect by the designer): M4 5; PS4 1 4 7; U4 54(PD2)

### Notes on the sheet
- CAN1 = [CAN1]: STM32-1 <-> SlotB (3.3V LL)
- CPU #3: STM32F415RGT6 @ 168 mhz
- CPU-1, 32-bt ARM MCPU
- UART2: [USART2]:
- USART2_TX {PA2} ==> UART2_A_ATmega8_RX
- USART2_RX {PA3} ==> UART2_A_ATmega8_TX
- UART5: [USART6]:
- I2C2: [I2C1]
- UART8: [USART3]:
- USART3_TX {PC10} ==> SlotC_UART_RX
- USART3_RX {PC11} ==> SlotC_UART_TX
- SPI5: [SPI3]
- SPI3_SCK {PB3} ==> SD_CPU1_SCK
- SPI3_SS {PC8} ==> SD_CPU1_CS
- SPI3_MOSI {PB5} ==> SD_CPU1_MOSI
- SPI3_MISO {PB4} ==> SD_CPU1_MISO
- SPI1 = [SPI2]: STM32-1 <-> Rasbperry Pi GPIO Slot (3.3V LL)
- I2C2 = [I2C1] : STM32-1 <-> STM32-0 (3.3V LL)
- I2C3 = [I2C2]: STM32-1 <-> Raspberry Pi GPIO Slot (3.3V LL)
- SPI3 = [SPI1]: STM32-1 <-> STM32-0 (3.3V LL)
- USART6_TX {PC6} ==> SlotB_UART_RX
- USART6_RX {PC7} ==> SlotB_UART_TX
- UART6: [USART1]:
- USART1_TX {PA9} ==> CPU1_UART6_TX
- I2C3: [I2C2]
- I2C2_SCL {PB10} ==> RPES_I2C_SCL
- I2C1_SCL {PB6} ==> CPU0_I2C2_SCL
- I2C1_SDA {PB7} ==> CPU0_I2C2_SDA
- SPI2: [SPI1]
- SPI1_MOSI {PA7} ==> RPES_SPI0_MOSI
- SPI1_MISO {PA6} ==> RPES_SPI0_MISO
- SPI1_SCK {PA5} ==> RPES_SPI0_SCK
- SPI3: [SPI2]
- SPI2_MOSI {PA7} ==> SPI3_MOSI
- SPI2_MISO {PA6} ==> SPI3_MISO
- SPI2_SCK {PA5} ==> SPI3_SCK
- SPI5 = [SPI3]: STM32-1 <-> SD CARD (3.3V LL)
- UART5 = [USART6] STM32-1 <-> SlotB (3.3V LL)
- UART2 = [USART2] STM32-1 <-> ATmega8 (3.3V - 5V LL)
- UART6 = [USART1]: STM32-1 <-> STM32-0 (3.3V LL)
- USART1_RX {PA10} ==> CPU1_UART6_RX
- (near U4) I2C2_SDA {PB11} ==> RPES_I2C_SDA
- SPI1_SS {PC6}
- SPI2_SS {PC7}
- USB5 = [USB Device]: STM32-1 <-> Raspberry Pi USB (Master Key)
- USB3 = [USB Device]: STM32-1 <-> VT6121L (Port #3)
- UART8 = [USART3] STM32-1 <-> SlotC (3.3V LL)
- (near C18) 32-bit MCPU #1 STM32
- (near M4) TXD
- (near M4) GND
- (near M4) VCC
- (near M4) RXD
- RS
- CANH
- (near M4) CANL
- (near M4) Vref
- STM32F415RGTx Motherboard 2 Schematic
- Prod
- 5
- Rev. A
- 9
- Nikita Shaparenko

### Library data of the parts
C16-C21 C36 C37 C39-C41 C43 C47 C48 C52 C53 = Cap2: Capacitor; Published: 23-Sep-2002; PackageReference: CAPR5-4X5; Publisher: Altium Limited; PackageDescription: Capacitor; 2 Leads
C38 C42 = Cap Pol1: Polarized Capacitor (Radial); Published: 8-Jun-2000; LatestRevisionDate: 17-Jul-2002; LatestRevisionNote: Re-released for DXP Platform.; PackageReference: RB7.6-15; Publisher: Altium Limited; PackageDescription: Polarized Capacitor (Radial); 2 Leads
M4 = SW-DIP4: DIP Switch; Published: 24-Mar-1999; LatestRevisionDate: 17-Jul-2002; LatestRevisionNote: Re-released for DXP Platform.; PackageReference: DIP-8; Publisher: Altium Limited
OSC2 = Plug: LatestRevisionDate: 17-Jul-2002; LatestRevisionNote: Re-released for DXP Platform.; Publisher: Altium Limited
PS4 = Header 5X2: Header, 5-Pin, Dual row; LatestRevisionDate: 17-Jul-2002; LatestRevisionNote: Re-released for DXP Platform.; Publisher: Altium Limited
R20 R23 R25 R48 R49 R53 R54 R58-R60 R62 R67 R71 R72 = Res2: Resistor; Published: 8-Jun-2000; LatestRevisionDate: 17-Jul-2002; LatestRevisionNote: Re-released for DXP Platform.; PackageReference: AXIAL-0.4; Publisher: Altium Limited; PackageDescription: Axial Device, Thru-Hole; 2 Leads; 0.4 in Pin Spacing
U4 = STM32F415RGT6: as U3 on sheet STM32 Motherboard; DatasheetVersion: Rev. 4; PackageVersion: Rev. 4, 06/2013; PackageReference: LQFP64; PackageDescription: 64-Pin Low Profile Quad Flat Package, 10 x 10 mm Body, 0.5 mm Pitch; Supplier 1: Digi-Key; Supplier Part Number 1: 497-11907-ND; Supplier 2: Farnell; Supplier Part Number 2: 2064370; Supplier 3: Newark; Supplier Part Number 3: 73T2335; Supplier 4: Mouser; Supplier Part Number 4: 511-STM32F415RGT6; Core: ARM Cortex-M4; Packing: Tray; Mounting Technology: Surface Mount; PartNumber: STM32F415RGT6; ComponentLink1Description: Manufacturer URL; ComponentLink1URL: http://www.st.com/web/en/home.html; ComponentLink2Description: Datasheet; ComponentLink2URL: http://www.st.com/st-web-ui/static/active/en/resource/technical/document/datasheet/DM00035129.pdf; ComponentLink3Description: Package Specification; ComponentLink3URL: http://www.st.com/st-web-ui/static/active/en/resource/technical/document/datasheet/DM00037051.pdf
W16 W18A W18B W19A W19B W19C W19D = Jumper: Jumper Wire; Published: 24-Mar-1999; LatestRevisionDate: 17-Jul-2002; LatestRevisionNote: Re-released for DXP Platform.; PackageReference: RAD-0.2; Publisher: Altium Limited; PackageDescription: Radial Cap, Thru-Hole; 2 Leads; 0.2 in Pin Spacing
Y5 Y6 = XTAL: Crystal Oscillator; Published: 8-Jun-2000; LatestRevisionDate: 17-Jul-2002; LatestRevisionNote: Re-released for DXP Platform.; PackageReference: R38; Publisher: Altium Limited; PackageDescription: Crystal, Thru-Hole; 2 Leads; Body 3.1 x 8.2 mm (Dia.xH)
W21A W21B = Circuit Breaker: Published: 24-Mar-1999; LatestRevisionDate: 17-Jul-2002; LatestRevisionNote: Re-released for DXP Platform.; PackageReference: SPST-2; Publisher: Altium Limited; PackageDescription: Switch; 2 Leads

## Sheet Raspberry Pi2+ Expansion Slot.SchDoc
size A4
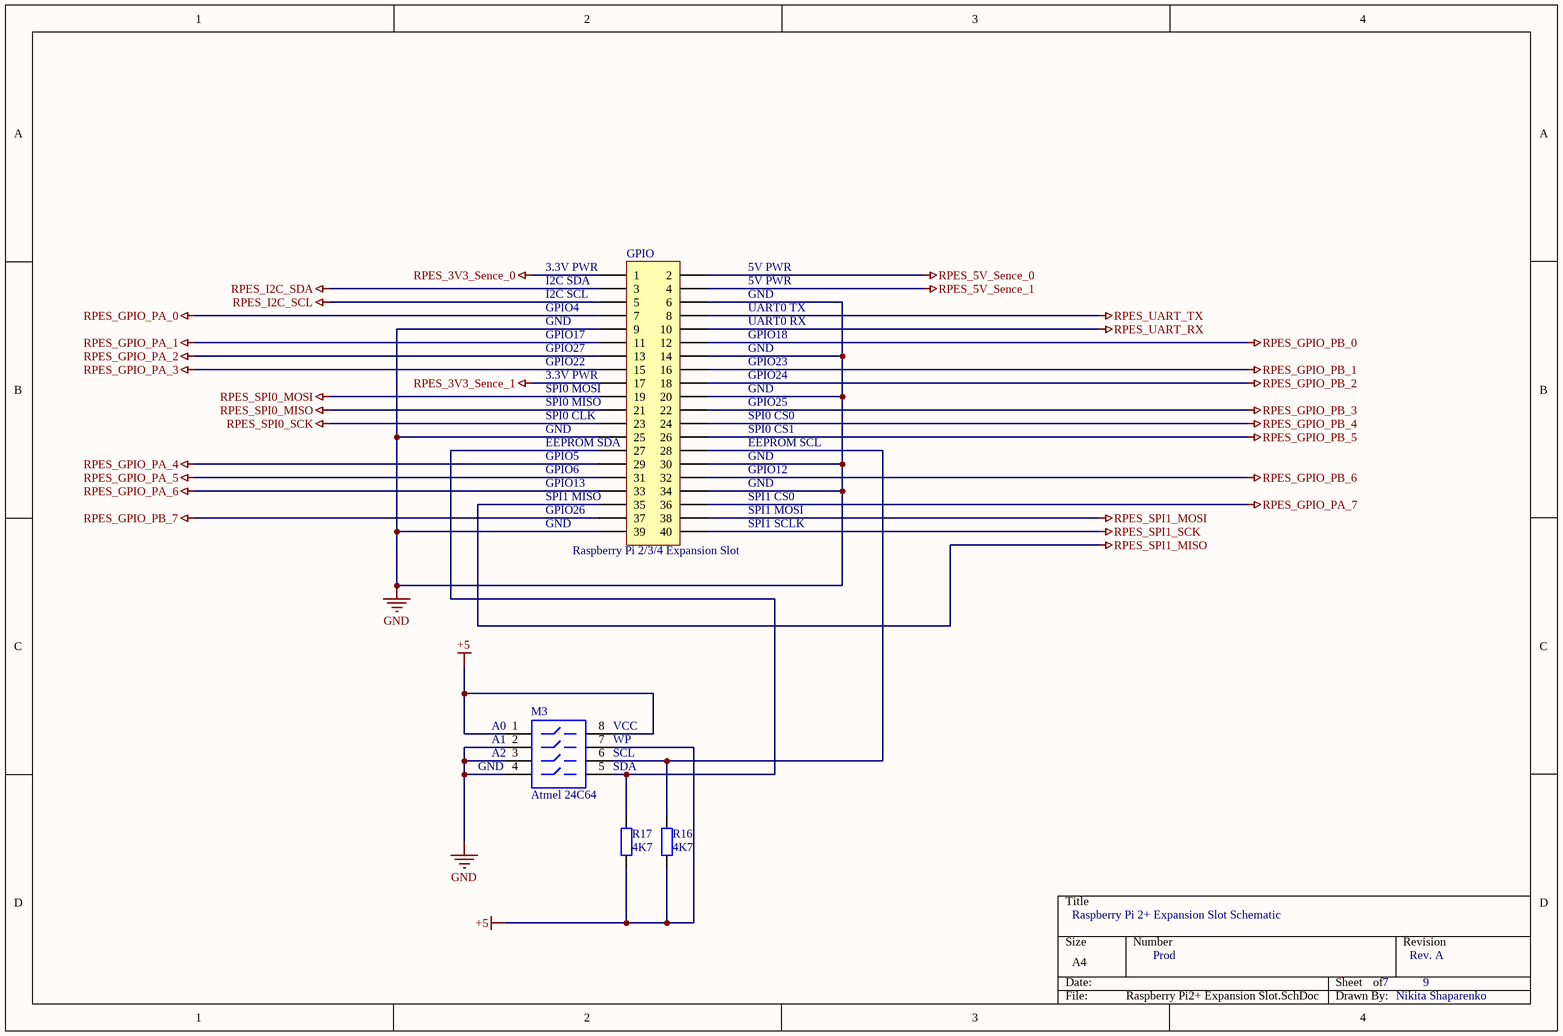
[diagram p3: Raspberry Pi2+ Expansion Slot.SchDoc]

### Parts
GPIO  Raspberry Pi 2/3/4 Expansion Slot  [HDR2X20]
M3  Atmel 24C64  [DIP-8]
R16  value 4K7  [AXIAL-0.4]  (hidden comment: Res2)
R17  value 4K7  [AXIAL-0.4]  (hidden comment: Res2)

### Nets
+5: M3.1 M3.7 M3.8 R16.1 R17.1
GND: GPIO.6 GPIO.9 GPIO.14 GPIO.20 GPIO.25 GPIO.30 GPIO.34 GPIO.39 M3.2 M3.3 M3.4
RPES_3V3_Sence_0: GPIO.1
RPES_3V3_Sence_1: GPIO.17
RPES_5V_Sence_0: GPIO.2
RPES_5V_Sence_1: GPIO.4
RPES_GPIO_PA_0: GPIO.7
RPES_GPIO_PA_1: GPIO.11
RPES_GPIO_PA_2: GPIO.13
RPES_GPIO_PA_3: GPIO.15
RPES_GPIO_PA_4: GPIO.29
RPES_GPIO_PA_5: GPIO.31
RPES_GPIO_PA_6: GPIO.33
RPES_GPIO_PA_7: GPIO.36
RPES_GPIO_PB_0: GPIO.12
RPES_GPIO_PB_1: GPIO.16
RPES_GPIO_PB_2: GPIO.18
RPES_GPIO_PB_3: GPIO.22
RPES_GPIO_PB_4: GPIO.24
RPES_GPIO_PB_5: GPIO.26
RPES_GPIO_PB_6: GPIO.32
RPES_GPIO_PB_7: GPIO.37
RPES_I2C_SCL: GPIO.5
RPES_I2C_SDA: GPIO.3
RPES_SPI0_MISO: GPIO.21
RPES_SPI0_MOSI: GPIO.19
RPES_SPI0_SCK: GPIO.23
RPES_SPI1_MISO: GPIO.35
RPES_SPI1_MOSI: GPIO.38
RPES_SPI1_SCK: GPIO.40
RPES_UART_RX: GPIO.10
RPES_UART_TX: GPIO.8
NetGPIO_27: GPIO.27 M3.5 R17.2
NetGPIO_28: GPIO.28 M3.6 R16.2

### Notes on the sheet
- (near GPIO) 3.3V PWR
- (near GPIO) I2C SDA
- (near GPIO) I2C SCL
- (near GPIO) GPIO4
- 5V PWR
- GND
- UART0 TX
- (near GPIO) GPIO17
- (near GPIO) GPIO27
- (near GPIO) GPIO22
- UART0 RX
- GPIO18
- GPIO23
- GPIO24
- (near GPIO) SPI0 MOSI
- (near GPIO) SPI0 MISO
- (near GPIO) SPI0 CLK
- (near GPIO) EEPROM SDA
- GPIO25
- SPI0 CS0
- SPI0 CS1
- EEPROM SCL
- (near GPIO) GPIO5
- (near GPIO) GPIO6
- (near GPIO) GPIO13
- (near GPIO) SPI1 MISO
- (near GPIO) GPIO26
- GPIO12
- SPI1 CS0
- SPI1 MOSI
- SPI1 SCLK
- (near M3) GND
- (near M3) A0
- (near M3) A1
- (near M3) A2
- (near M3) SDA
- (near M3) SCL
- (near M3) WP
- (near M3) VCC
- Raspberry Pi 2+ Expansion Slot Schematic
- Prod
- 7
- Rev. A
- 9
- Nikita Shaparenko

### Library data of the parts
GPIO = Header 20X2: Header, 20-Pin, Dual row; LatestRevisionDate: 17-Jul-2002; LatestRevisionNote: Re-released for DXP Platform.; Publisher: Altium Limited
M3 = SW-DIP4: DIP Switch; Published: 24-Mar-1999; LatestRevisionDate: 17-Jul-2002; LatestRevisionNote: Re-released for DXP Platform.; PackageReference: DIP-8; Publisher: Altium Limited
R16 R17 = Res2: Resistor; Published: 8-Jun-2000; LatestRevisionDate: 17-Jul-2002; LatestRevisionNote: Re-released for DXP Platform.; PackageReference: AXIAL-0.4; Publisher: Altium Limited; PackageDescription: Axial Device, Thru-Hole; 2 Leads; 0.4 in Pin Spacing

## Sheet Shifters.SchDoc
size A4
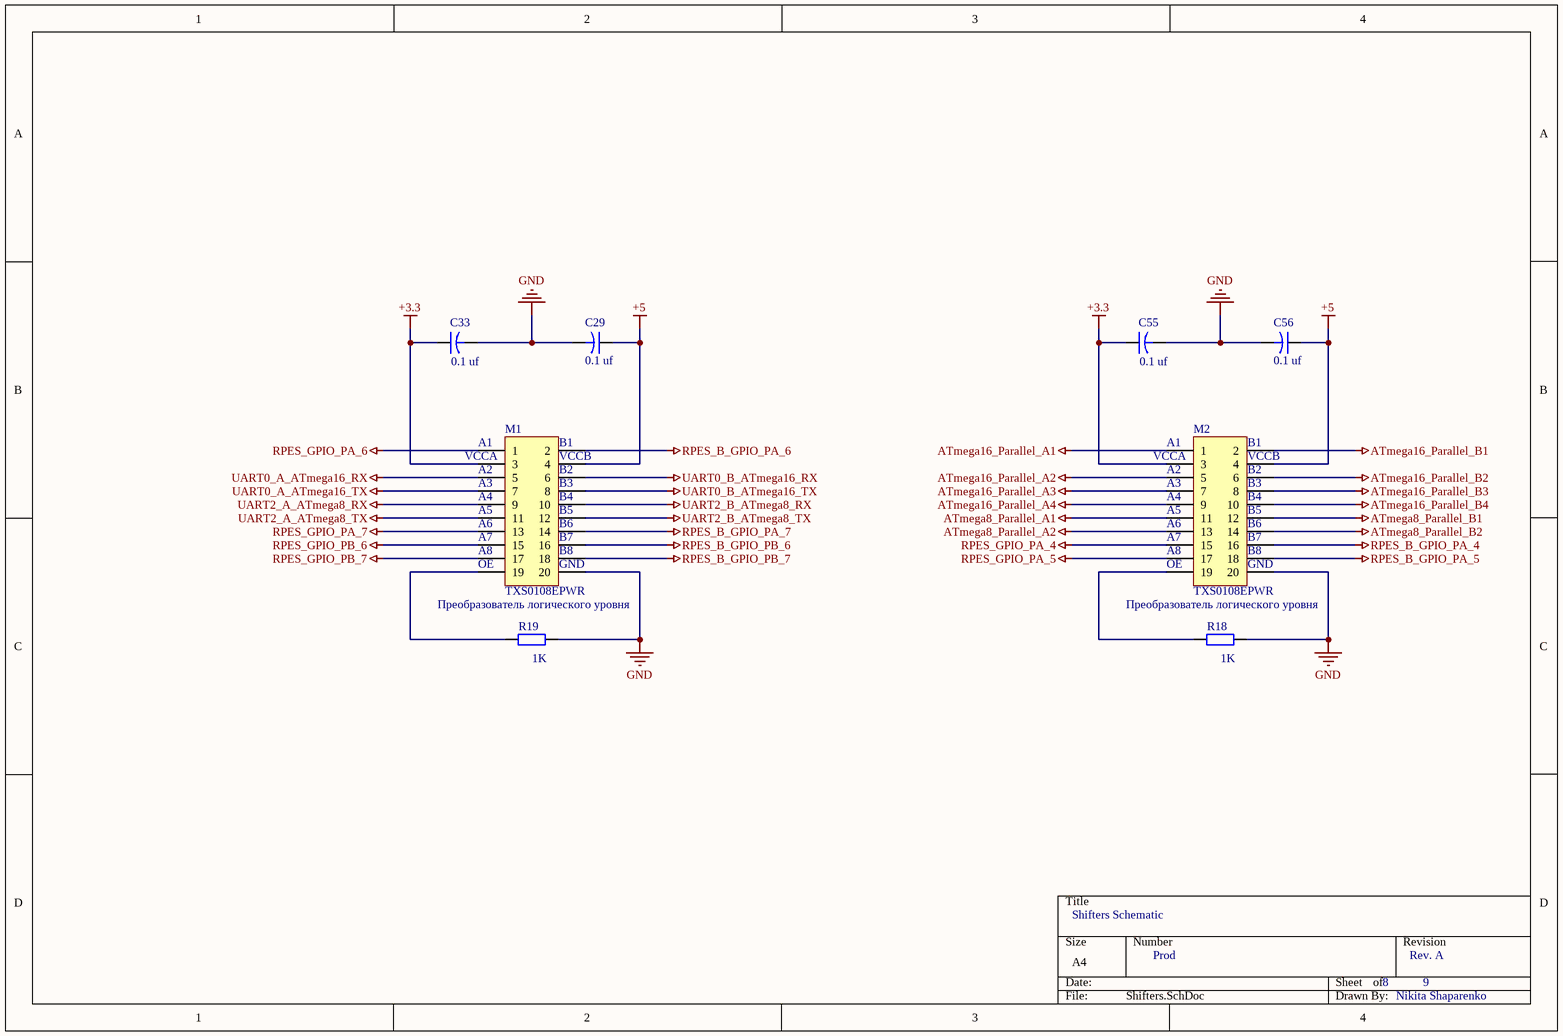
[diagram p4: Shifters.SchDoc]

### Parts
C29  value 0.1 uf  [CAPR5-4X5]  (hidden comment: Cap2)
C33  value 0.1 uf  [CAPR5-4X5]  (hidden comment: Cap2)
C55  value 0.1 uf  [CAPR5-4X5]  (hidden comment: Cap2)
C56  value 0.1 uf  [CAPR5-4X5]  (hidden comment: Cap2)
M1  TXS0108EPWR  [TSSOP20]
M2  TXS0108EPWR  [TSSOP20]
R18  value 1K  [AXIAL-0.4]  (hidden comment: Res2)
R19  value 1K  [AXIAL-0.4]  (hidden comment: Res2)

### Nets
+3.3: C33.1 C55.1 M1.3 M2.3
+5: C29.1 C56.1 M1.4 M2.4
ATmega8_Parallel_A1: M2.11
ATmega8_Parallel_A2: M2.13
ATmega8_Parallel_B1: M2.12
ATmega8_Parallel_B2: M2.14
ATmega16_Parallel_A1: M2.1
ATmega16_Parallel_A2: M2.5
ATmega16_Parallel_A3: M2.7
ATmega16_Parallel_A4: M2.9
ATmega16_Parallel_B1: M2.2
ATmega16_Parallel_B2: M2.6
ATmega16_Parallel_B3: M2.8
ATmega16_Parallel_B4: M2.10
GND: C29.2 C33.2 C55.2 C56.2 M1.20 M2.20 R18.2 R19.2
RPES_B_GPIO_PA_4: M2.16
RPES_B_GPIO_PA_5: M2.18
RPES_B_GPIO_PA_6: M1.2
RPES_B_GPIO_PA_7: M1.14
RPES_B_GPIO_PB_6: M1.16
RPES_B_GPIO_PB_7: M1.18
RPES_GPIO_PA_4: M2.15
RPES_GPIO_PA_5: M2.17
RPES_GPIO_PA_6: M1.1
RPES_GPIO_PA_7: M1.13
RPES_GPIO_PB_6: M1.15
RPES_GPIO_PB_7: M1.17
UART0_A_ATmega16_RX: M1.5
UART0_A_ATmega16_TX: M1.7
UART0_B_ATmega16_RX: M1.6
UART0_B_ATmega16_TX: M1.8
UART2_A_ATmega8_RX: M1.9
UART2_A_ATmega8_TX: M1.11
UART2_B_ATmega8_RX: M1.10
UART2_B_ATmega8_TX: M1.12
NetM1_19: M1.19 R19.1
NetM2_19: M2.19 R18.1

### Notes on the sheet
- (near M1) A1
- (near M1) B1
- (near M2) A1
- (near M2) B1
- (near M1) VCCA
- (near M1) A2
- (near M1) A3
- (near M1) A4
- (near M1) A5
- (near M1) VCCB
- (near M1) B2
- (near M1) B3
- (near M1) B4
- (near M1) B5
- (near M2) VCCA
- (near M2) A2
- (near M2) A3
- (near M2) A4
- (near M2) A5
- (near M2) VCCB
- (near M2) B2
- (near M2) B3
- (near M2) B4
- (near M2) B5
- (near M1) A6
- (near M1) A7
- (near M1) A8
- (near M1) OE
- (near M1) B6
- (near M1) B7
- (near M1) B8
- (near M1) GND
- (near M2) A6
- (near M2) A7
- (near M2) A8
- (near M2) OE
- (near M2) B6
- (near M2) B7
- (near M2) B8
- (near M2) GND
- Преобразователь логического уровня
- Shifters Schematic
- Prod
- 8
- Rev. A
- 9
- Nikita Shaparenko

### Library data of the parts
C29 C33 C55 C56 = Cap2: Capacitor; Published: 23-Sep-2002; PackageReference: CAPR5-4X5; Publisher: Altium Limited; PackageDescription: Capacitor; 2 Leads
M1 M2 = Header 10X2: Header, 10-Pin, Dual row; LatestRevisionDate: 17-Jul-2002; LatestRevisionNote: Re-released for DXP Platform.; Publisher: Altium Limited
R18 R19 = Res2: Resistor; Published: 8-Jun-2000; LatestRevisionDate: 17-Jul-2002; LatestRevisionNote: Re-released for DXP Platform.; PackageReference: AXIAL-0.4; Publisher: Altium Limited; PackageDescription: Axial Device, Thru-Hole; 2 Leads; 0.4 in Pin Spacing

## Sheet Sockets.SchDoc
size A4
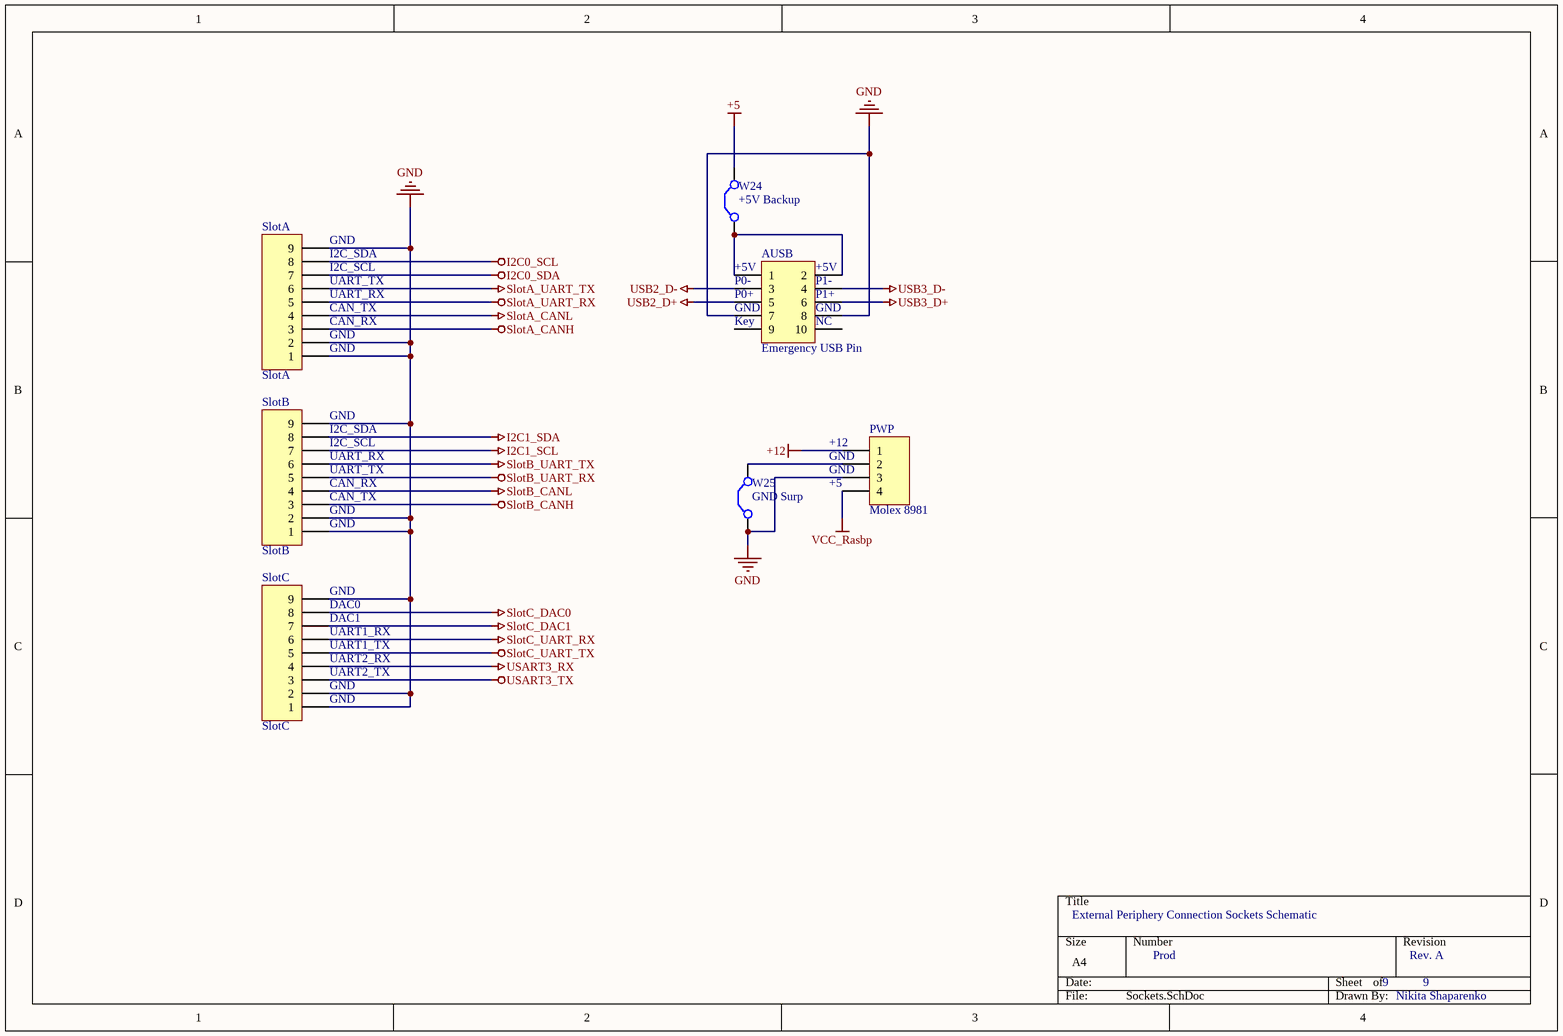
[diagram p5: Sockets.SchDoc]

### Parts
AUSB  Emergency USB Pin  [HDR2X5]
PWP  Molex 8981  [HDR1X4]
SlotA  SlotA  [SATA Socket]
SlotB  SlotB  [SATA Socket]
SlotC  SlotC  [SATA Socket]
W24  +5V Backup  [RAD-0.1]
W25  GND Surp  [RAD-0.1]

### Nets
+5: W24.2(C2)
+12: PWP.1
GND: AUSB.7 AUSB.8 PWP.3 SlotA.1 SlotA.2 SlotA.9 SlotB.1 SlotB.2 SlotB.9 SlotC.1 SlotC.2 SlotC.9 W25.1(C1)
I2C0_SCL: SlotA.8
I2C0_SDA: SlotA.7
I2C1_SCL: SlotB.7
I2C1_SDA: SlotB.8
SlotA_CANH: SlotA.3
SlotA_CANL: SlotA.4
SlotA_UART_RX: SlotA.5
SlotA_UART_TX: SlotA.6
SlotB_CANH: SlotB.3
SlotB_CANL: SlotB.4
SlotB_UART_RX: SlotB.5
SlotB_UART_TX: SlotB.6
SlotC_DAC0: SlotC.8
SlotC_DAC1: SlotC.7
SlotC_UART_RX: SlotC.6
SlotC_UART_TX: SlotC.5
USART3_RX: SlotC.4
USART3_TX: SlotC.3
USB2_D+: AUSB.5
USB2_D-: AUSB.3
USB3_D+: AUSB.6
USB3_D-: AUSB.4
VCC_Rasbp: PWP.4
NetAUSB_1: AUSB.1 AUSB.2 W24.1(C1)
NetPWP_2: PWP.2 W25.2(C2)

Not connected (* = marked no-connect by the designer): AUSB 9 10

### Notes on the sheet
- (near SlotA) GND
- (near SlotA) I2C_SDA
- (near SlotA) I2C_SCL
- (near SlotA) UART_TX
- (near SlotA) UART_RX
- (near SlotA) CAN_TX
- (near AUSB) +5V
- (near AUSB) P0-
- (near AUSB) P0+
- (near AUSB) GND
- (near AUSB) P1-
- (near AUSB) P1+
- (near SlotA) CAN_RX
- (near AUSB) Key
- (near AUSB) NC
- (near SlotB) GND
- (near SlotB) I2C_SDA
- (near SlotB) I2C_SCL
- (near PWP) +12
- (near SlotB) UART_TX
- (near SlotB) UART_RX
- (near SlotB) CAN_TX
- (near SlotB) CAN_RX
- (near PWP) GND
- (near PWP) +5
- (near SlotC) GND
- (near SlotC) DAC0
- (near SlotC) DAC1
- (near SlotC) UART1_TX
- (near SlotC) UART1_RX
- (near SlotC) UART2_TX
- (near SlotC) UART2_RX
- External Periphery Connection Sockets Schematic
- Prod
- 9
- Rev. A
- Nikita Shaparenko

### Library data of the parts
AUSB = Header 5X2: Header, 5-Pin, Dual row; LatestRevisionDate: 17-Jul-2002; LatestRevisionNote: Re-released for DXP Platform.; Publisher: Altium Limited
PWP = Header 4: Header, 4-Pin; LatestRevisionDate: 17-Jul-2002; LatestRevisionNote: Re-released for DXP Platform.; Publisher: Altium Limited
SlotA SlotB SlotC = Header 9: Header, 9-Pin; LatestRevisionDate: 17-Jul-2002; LatestRevisionNote: Re-released for DXP Platform.; Publisher: Altium Limited
W24 W25 = Jumper: Jumper Wire; Published: 24-Mar-1999; LatestRevisionDate: 17-Jul-2002; LatestRevisionNote: Re-released for DXP Platform.; PackageReference: RAD-0.2; Publisher: Altium Limited; PackageDescription: Radial Cap, Thru-Hole; 2 Leads; 0.2 in Pin Spacing

## Nets that join several sheets
+3.3: ATmega Motherboard (W17B.2), STM32 Motherboard (20 pins), STM32 Motherboard 2 (16 pins), Shifters (C33.1 C55.1 M1.3 M2.3)
+5: ATmega Motherboard (18 pins), STM32 Motherboard (M5.3 M6.5 R56.2 W15B.1), STM32 Motherboard 2 (M4.3 R67.2 W18A.1), Raspberry Pi2+ Expansion Slot (5 pins), Shifters (C29.1 C56.1 M1.4 M2.4), Sockets (W24.2)
+12: STM32 Motherboard (R22.2), STM32 Motherboard 2 (R23.2), Sockets (PWP.1)
ATmega16_Parallel_B1: ATmega Motherboard (U2.11), Shifters (M2.2)
ATmega16_Parallel_B2: ATmega Motherboard (U2.12), Shifters (M2.6)
CPU1_UART6_RX: STM32 Motherboard (U3.51), STM32 Motherboard 2 (U4.43)
CPU1_UART6_TX: STM32 Motherboard (U3.52), STM32 Motherboard 2 (U4.42)
GND: ATmega Motherboard (32 pins), STM32 Motherboard (31 pins), STM32 Motherboard 2 (24 pins), Raspberry Pi2+ Expansion Slot (11 pins), Shifters (8 pins), Sockets (13 pins)
I2C0_SCL: ATmega Motherboard (R1.2 U1.22), Sockets (SlotA.8)
I2C0_SDA: ATmega Motherboard (R2.2 U1.23), Sockets (SlotA.7)
I2C1_SCL: ATmega Motherboard (R9.2 U2.28), Sockets (SlotB.7)
I2C1_SDA: ATmega Motherboard (R8.2 U2.27), Sockets (SlotB.8)
LED_BLUE: ATmega Motherboard (U1.26), STM32 Motherboard (R50.2)
LED_RED: ATmega Motherboard (U1.25), STM32 Motherboard (R34.2)
RPES_3V3_Sence_0: STM32 Motherboard (R21.1), Raspberry Pi2+ Expansion Slot (GPIO.1)
RPES_3V3_Sence_1: STM32 Motherboard 2 (R53.1), Raspberry Pi2+ Expansion Slot (GPIO.17)
RPES_5V_Sence_0: ATmega Motherboard (U1.39), Raspberry Pi2+ Expansion Slot (GPIO.2)
RPES_5V_Sence_1: ATmega Motherboard (U2.24), Raspberry Pi2+ Expansion Slot (GPIO.4)
RPES_B_GPIO_PA_4: ATmega Motherboard (U1.36), Shifters (M2.16)
RPES_B_GPIO_PA_5: ATmega Motherboard (U1.37), Shifters (M2.18)
RPES_B_GPIO_PA_6: ATmega Motherboard (U1.21), Shifters (M1.2)
RPES_B_GPIO_PA_7: ATmega Motherboard (U1.38), Shifters (M1.14)
RPES_B_GPIO_PB_6: ATmega Motherboard (U2.6), Shifters (M1.16)
RPES_B_GPIO_PB_7: ATmega Motherboard (U2.25), Shifters (M1.18)
RPES_GPIO_PA_0: STM32 Motherboard (U3.26), Raspberry Pi2+ Expansion Slot (GPIO.7)
RPES_GPIO_PA_1: STM32 Motherboard (U3.27), Raspberry Pi2+ Expansion Slot (GPIO.11)
RPES_GPIO_PA_2: STM32 Motherboard (U3.8), Raspberry Pi2+ Expansion Slot (GPIO.13)
RPES_GPIO_PA_3: STM32 Motherboard (U3.9), Raspberry Pi2+ Expansion Slot (GPIO.15)
RPES_GPIO_PA_4: STM32 Motherboard (U3.24), Raspberry Pi2+ Expansion Slot (GPIO.29), Shifters (M2.15)
RPES_GPIO_PA_5: STM32 Motherboard (U3.25), Raspberry Pi2+ Expansion Slot (GPIO.31), Shifters (M2.17)
RPES_GPIO_PA_6: Raspberry Pi2+ Expansion Slot (GPIO.33), Shifters (M1.1)
RPES_GPIO_PA_7: Raspberry Pi2+ Expansion Slot (GPIO.36), Shifters (M1.13)
RPES_GPIO_PB_0: STM32 Motherboard 2 (U4.26), Raspberry Pi2+ Expansion Slot (GPIO.12)
RPES_GPIO_PB_1: STM32 Motherboard 2 (U4.27), Raspberry Pi2+ Expansion Slot (GPIO.16)
RPES_GPIO_PB_2: STM32 Motherboard 2 (U4.8), Raspberry Pi2+ Expansion Slot (GPIO.18)
RPES_GPIO_PB_3: STM32 Motherboard 2 (U4.9), Raspberry Pi2+ Expansion Slot (GPIO.22)
RPES_GPIO_PB_4: STM32 Motherboard 2 (U4.24), Raspberry Pi2+ Expansion Slot (GPIO.24)
RPES_GPIO_PB_5: STM32 Motherboard 2 (U4.25), Raspberry Pi2+ Expansion Slot (GPIO.26)
RPES_GPIO_PB_6: Raspberry Pi2+ Expansion Slot (GPIO.32), Shifters (M1.15)
RPES_GPIO_PB_7: Raspberry Pi2+ Expansion Slot (GPIO.37), Shifters (M1.17)
RPES_I2C_SCL: STM32 Motherboard 2 (U4.58), Raspberry Pi2+ Expansion Slot (GPIO.5)
RPES_I2C_SDA: STM32 Motherboard 2 (U4.59), Raspberry Pi2+ Expansion Slot (GPIO.3)
RPES_SPI0_MISO: STM32 Motherboard (U3.22), Raspberry Pi2+ Expansion Slot (GPIO.21)
RPES_SPI0_MOSI: STM32 Motherboard (U3.23), Raspberry Pi2+ Expansion Slot (GPIO.19)
RPES_SPI0_SCK: STM32 Motherboard (U3.21), Raspberry Pi2+ Expansion Slot (GPIO.23)
RPES_SPI1_MISO: STM32 Motherboard 2 (U4.22), Raspberry Pi2+ Expansion Slot (GPIO.35)
RPES_SPI1_MOSI: STM32 Motherboard 2 (U4.23), Raspberry Pi2+ Expansion Slot (GPIO.38)
RPES_SPI1_SCK: STM32 Motherboard 2 (U4.21), Raspberry Pi2+ Expansion Slot (GPIO.40)
RPES_UART_RX: STM32 Motherboard (U3.42), Raspberry Pi2+ Expansion Slot (GPIO.10)
RPES_UART_TX: STM32 Motherboard (U3.43), Raspberry Pi2+ Expansion Slot (GPIO.8)
SD_CPU0_CS: ATmega Motherboard (P2.4), STM32 Motherboard (U3.39)
SD_CPU0_MISO: ATmega Motherboard (P2.7), STM32 Motherboard (U3.56)
SD_CPU0_MOSI: ATmega Motherboard (P2.5), STM32 Motherboard (U3.57)
SD_CPU0_SCK: ATmega Motherboard (P2.6), STM32 Motherboard (U3.55)
SD_CPU1_CS: ATmega Motherboard (W20A.2), STM32 Motherboard 2 (U4.39)
SD_CPU1_MISO: ATmega Motherboard (W20D.2), STM32 Motherboard 2 (U4.56)
SD_CPU1_MOSI: ATmega Motherboard (W20B.2), STM32 Motherboard 2 (U4.57)
SD_CPU1_SCK: ATmega Motherboard (W20C.2), STM32 Motherboard 2 (U4.55)
SlotA_CANH: STM32 Motherboard (M5.7), Sockets (SlotA.3)
SlotA_CANL: STM32 Motherboard (M5.6), Sockets (SlotA.4)
SlotA_UART_RX: STM32 Motherboard (U3.37), Sockets (SlotA.5)
SlotA_UART_TX: STM32 Motherboard (U3.38), Sockets (SlotA.6)
SlotB_CANH: STM32 Motherboard 2 (M4.7), Sockets (SlotB.3)
SlotB_CANL: STM32 Motherboard 2 (M4.6), Sockets (SlotB.4)
SlotB_UART_RX: STM32 Motherboard 2 (U4.37), Sockets (SlotB.5)
SlotB_UART_TX: STM32 Motherboard 2 (U4.38), Sockets (SlotB.6)
SlotC_DAC0: STM32 Motherboard (U3.20), Sockets (SlotC.8)
SlotC_DAC1: STM32 Motherboard 2 (U4.20), Sockets (SlotC.7)
SlotC_UART_RX: STM32 Motherboard (U3.53), Sockets (SlotC.6)
SlotC_UART_TX: STM32 Motherboard (U3.54), Sockets (SlotC.5)
SPI2_SS: STM32 Motherboard (U3.2), STM32 Motherboard 2 (U4.2)
SPI3_MISO: STM32 Motherboard (U3.10), STM32 Motherboard 2 (U4.10)
SPI3_MOSI: STM32 Motherboard (U3.11), STM32 Motherboard 2 (U4.11)
SPI3_SCK: STM32 Motherboard (U3.34), STM32 Motherboard 2 (U4.34)
UART0_A_ATmega16_RX: STM32 Motherboard (U3.16), Shifters (M1.5)
UART0_A_ATmega16_TX: STM32 Motherboard (U3.17), Shifters (M1.7)
UART0_B_ATmega16_RX: ATmega Motherboard (U1.14), Shifters (M1.6)
UART0_B_ATmega16_TX: ATmega Motherboard (U1.15), Shifters (M1.8)
UART2_A_ATmega8_RX: STM32 Motherboard 2 (U4.16), Shifters (M1.9)
UART2_A_ATmega8_TX: STM32 Motherboard 2 (U4.17), Shifters (M1.11)
USART3_RX: STM32 Motherboard 2 (U4.52), Sockets (SlotC.4)
USART3_TX: STM32 Motherboard 2 (U4.51), Sockets (SlotC.3)
USB2_D+: STM32 Motherboard (R51.1), Sockets (AUSB.5)
USB2_D-: STM32 Motherboard (R42.1), Sockets (AUSB.3)
USB3_D+: STM32 Motherboard 2 (R72.1), Sockets (AUSB.6)
USB3_D-: STM32 Motherboard 2 (R54.1), Sockets (AUSB.4)